# EAGLE board offical board (EAGLE 6.5.0)
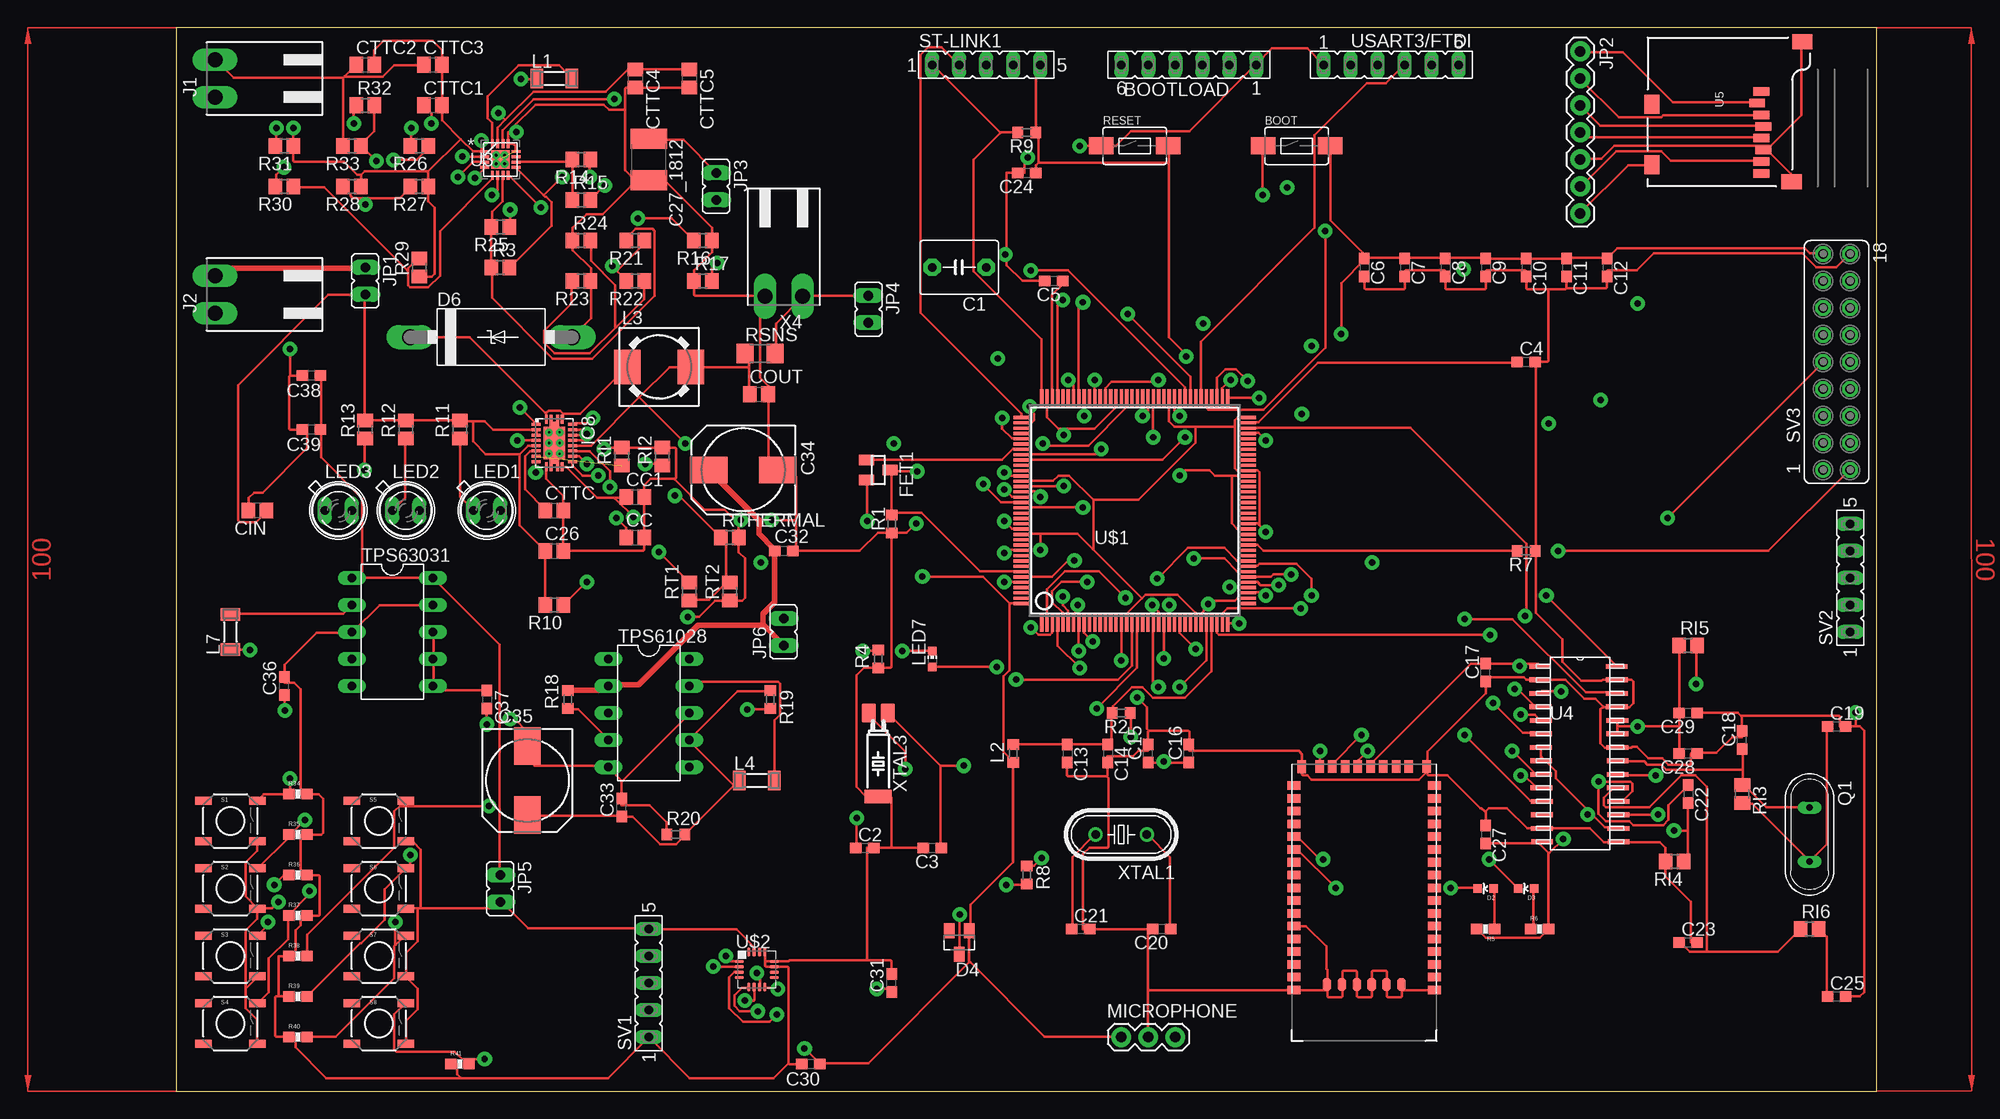
[diagram p6: board, top side]
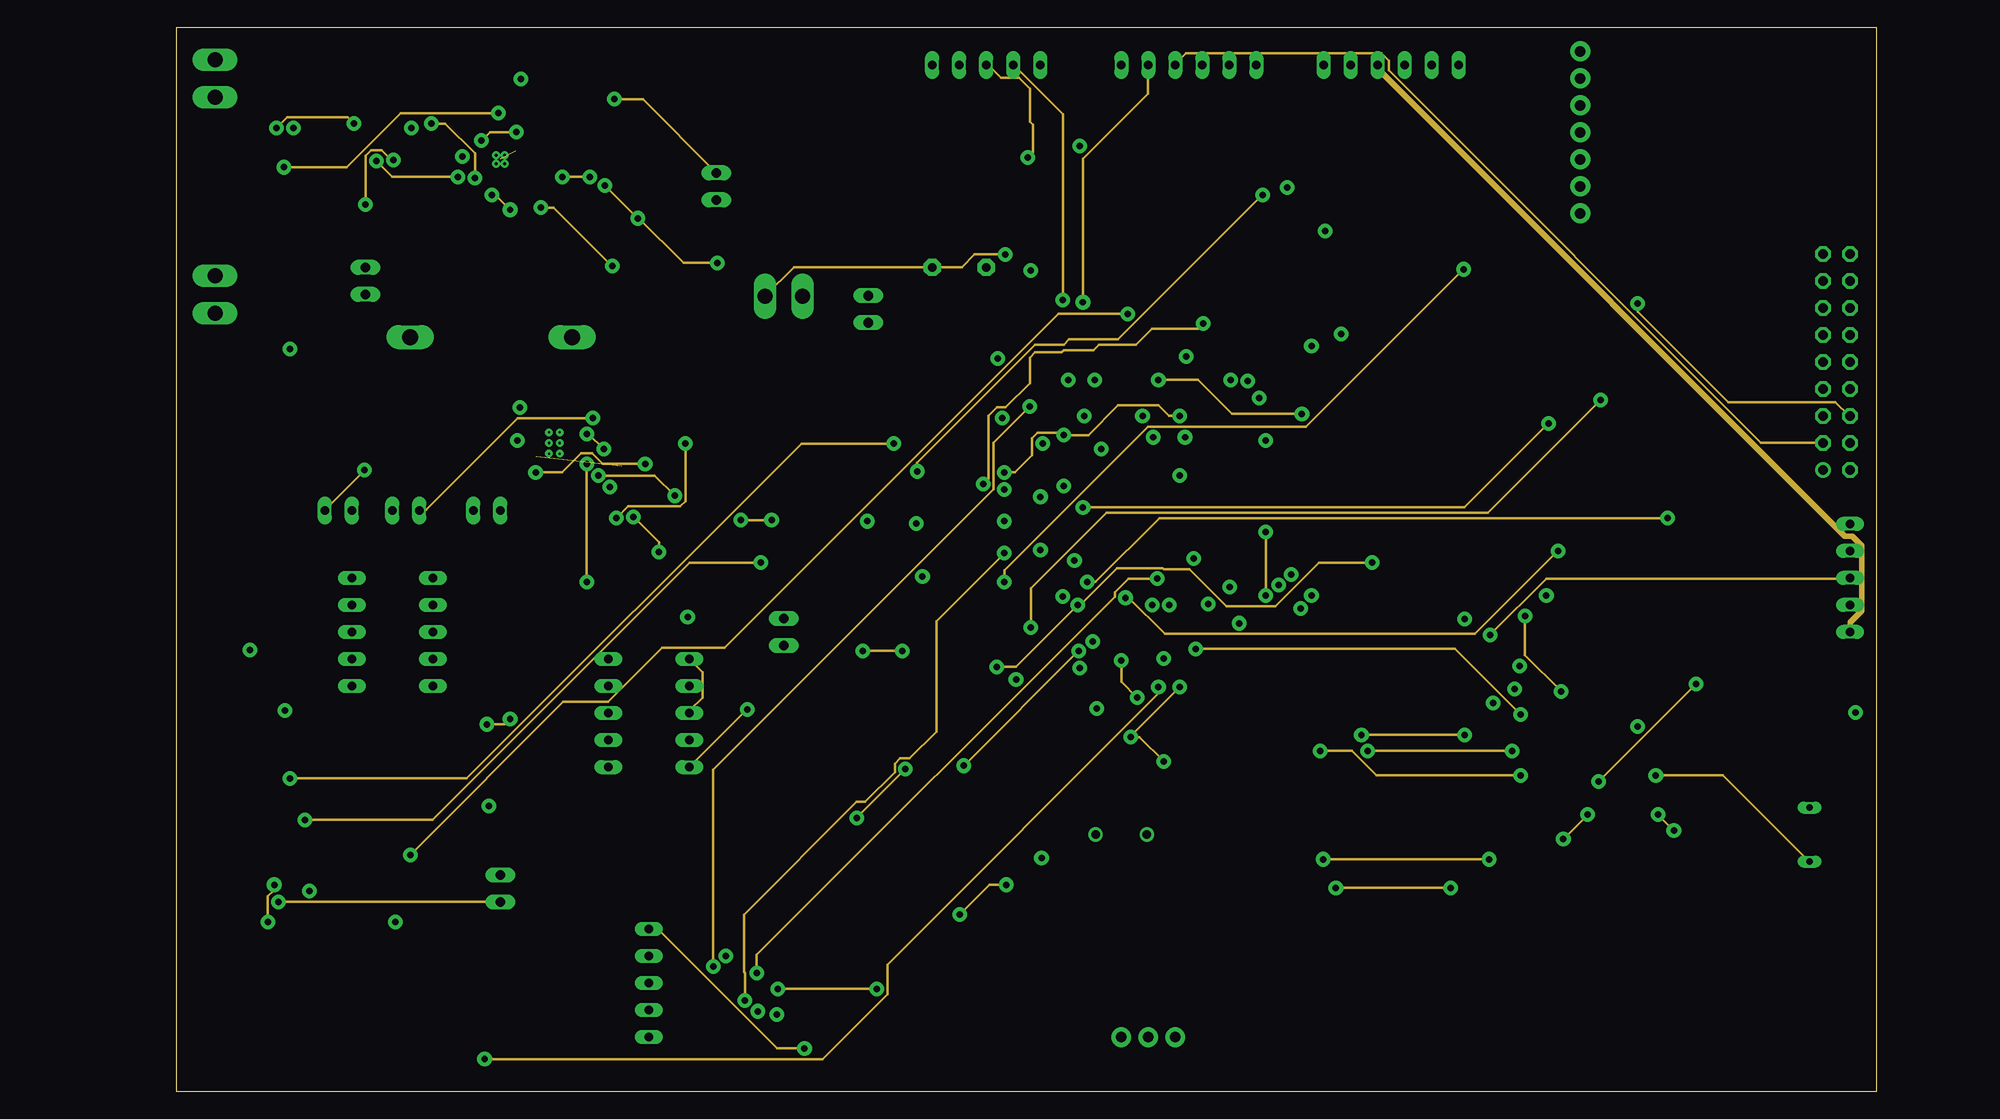
[diagram p7: board, inner layer Route2]
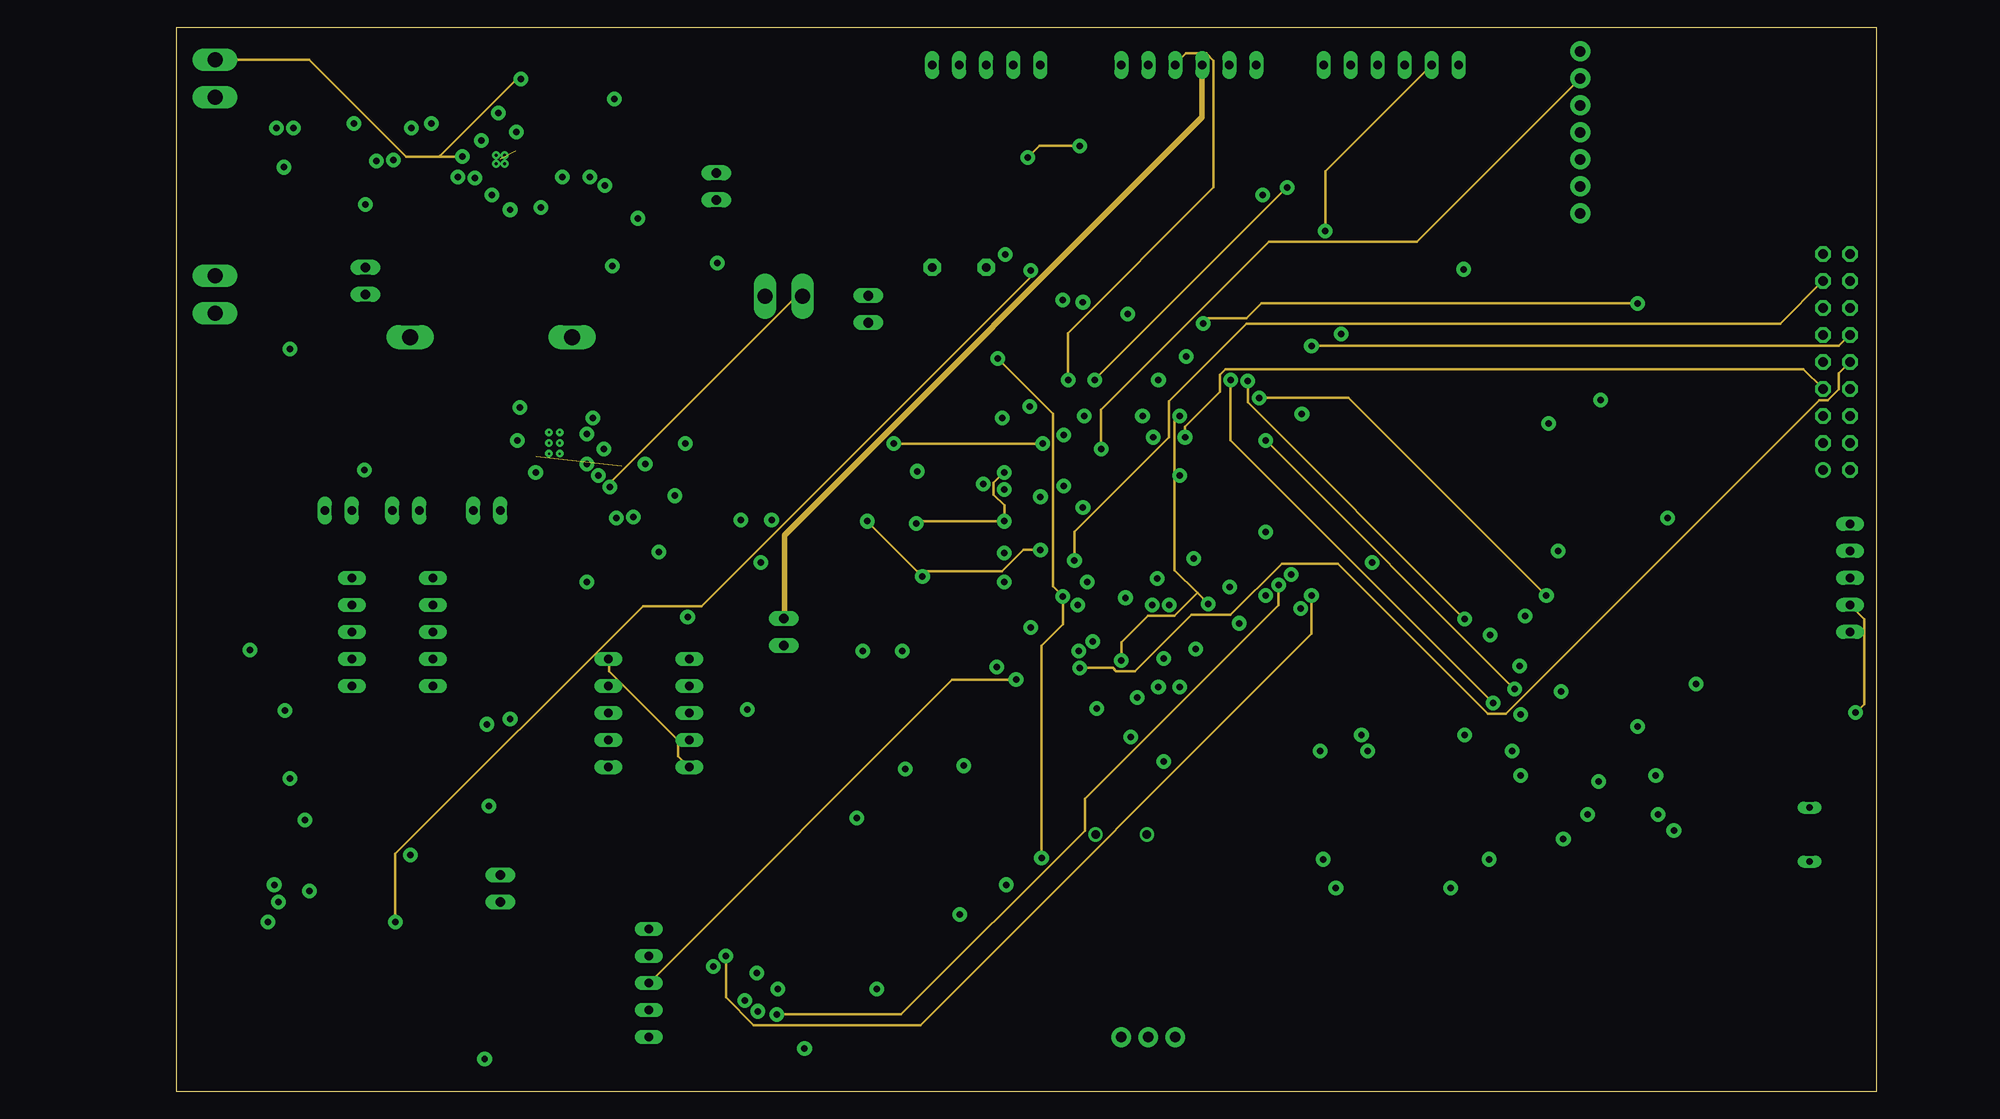
[diagram p8: board, inner layer Route3]
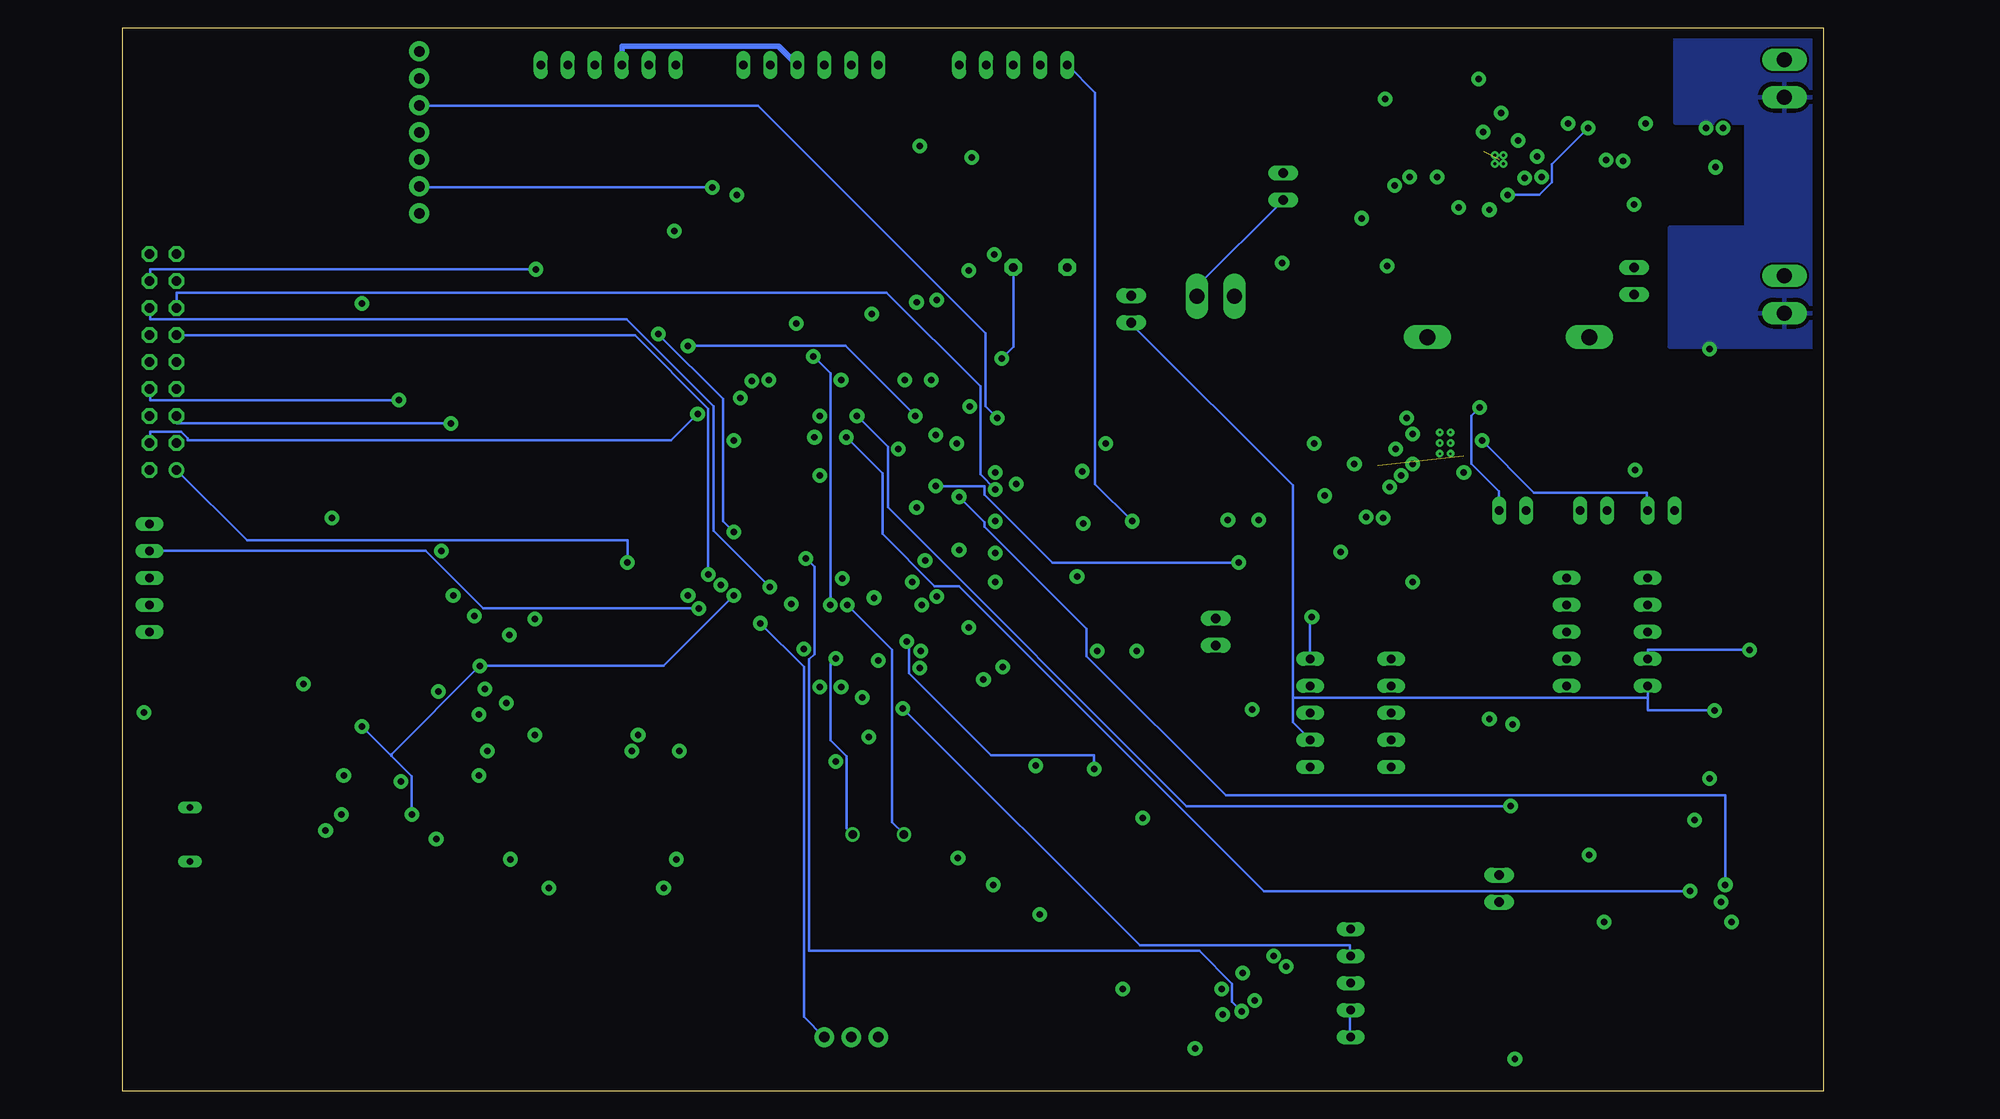
[diagram p9: board, bottom side, seen from below]

Size 160 x 100 mm. Coordinates in mm from the lower left corner, seen from the top.
Outline: 0,0 160,0 160,100 0,100 0,0
Copper layers (1*2*3*16): Top 0.035mm / dielectric 1.5mm / Route2 0.035mm / dielectric 0.15mm / Route3 0.035mm / dielectric 0.2mm / Bottom 0.035mm
Design rules "default *": minimum track width 10mil, minimum drill 24mil, track to track 7mil, track to pad 7mil, pad to pad 7mil, via to via 7mil, smd to smd 7mil, copper to edge 40mil, drill to drill 15mil, minimum pad ring 10mil, minimum via ring 15mil, stop-mask expansion 4mil, vias tented up to drill 0mil, thermal gap 15mil
Net classes: 2 thin_power: width 0.254 mm; 3 power usb: width 0.508 mm, drill 0.406 mm, clearance 0.203 mm

## Footprints (pad centres in the part's own frame; a part is rotated, then mirrored left to right if it is on the bottom)
TACTILE-SWITCH-1101NE = smd 2.3 x 1.6: P$1 -3.15,0; P$2 3.15,0
FE06 = drill 0.813 long: 1 -6.35,0; 2 -3.81,0; 3 -1.27,0; 4 1.27,0; 5 3.81,0; 6 6.35,0
C5B5 = drill 0.813 pad 1.6 octagon: 1 -2.54,0; 2 2.54,0
C0603 = smd 1.1 x 1: 1 -0.85,0; 2 0.85,0
C0805 = smd 1.3 x 1.5: 1 -0.85,0; 2 0.85,0
C1812 = smd 1.9 x 3.4: 1 -1.95,0; 2 1.95,0
150CLZ-0810 = smd 3.5 x 2.5: + 3.25,0; - -3.25,0
LED-0603 = smd 0.8 x 0.8: A 0,-0.75; C 0,0.75
SOT23 = smd 1 x 1.4: 1 -0.95,-1.1; 2 0.95,-1.1; 3 0,1.1
C4111-15 = drill 1.499 long: A 7.62,0; C -7.62,0
SUPER-SOT3 = smd 1 x 1.4: 1 -0.95,-1.1; 2 0.95,-1.1; 3 0,1.1
QFN20_3,5X4,5 = smd 0.85 x 0.28: 1 -2.225,-0.75; 10 2.225,-0.75; 11 2.225,0.75; 20 -2.225,0.75 | smd 0.28 x 0.85: 2 -1.75,-1.725; 3 -1.25,-1.725; 4 -0.75,-1.725; 5 -0.25,-1.725; 6 0.25,-1.725; 7 0.75,-1.725; 8 1.25,-1.725; 9 1.75,-1.725; 12 1.75,1.725; 13 1.25,1.725; 14 0.75,1.725; 15 0.25,1.725; 16 -0.25,1.725; 17 -0.75,1.725; 18 -1.25,1.725; 19 -1.75,1.725 | smd 3.05 x 2.05: EXP 0,0 | drill 0.2 pad 0.3: EXP@1 -1,0.5; EXP@2 0,0.5; EXP@3 1,0.5; EXP@4 -1,-0.5; EXP@5 0,-0.5; EXP@6 1,-0.5 | smd 1.125 x 0.28: EXP@7 -2.075,0.3; EXP@8 -2.075,-0.3; EXP@9 2.075,0.3; EXP@10 2.075,-0.3 | smd 0.45 x 0.4: EXP@11 -1.75,0; EXP@12 1.75,0
90-2 = drill 1.422 long: 1 -1.75,5.25; 2 1.75,5.25
JP1 = drill 0.914 long: 1 0,-1.27; 2 0,1.27
1X07 = drill 1.016 pad 1.88: 1 0,0; 2 2.54,0; 3 5.08,0; 4 7.62,0; 5 10.16,0; 6 12.7,0; 7 15.24,0
SM-1206 = smd 1.2 x 1.8: 1 -1.65,0; 2 1.65,0
RCL_L0603 = smd 1 x 1.1: 1 -0.85,0; 2 0.85,0
DR73 = smd 2.5 x 3.25: 1 -3,0; 2 3,0
SFH482 = drill 0.813 long: A -1.27,0; K 1.27,0
CHIP-LED0603 = smd 0.8 x 0.8: A 0,-0.75; C 0,0.75
1X03 = drill 1.016 pad 1.88: 1 0,0; 2 2.54,0; 3 5.08,0
QS = drill 0.61 long: 1 -2.54,0; 2 2.54,0
R0603 = smd 1 x 1.1: 1 -0.85,0; 2 0.85,0
R0805 = smd 1.3 x 1.5: 1 -0.85,0; 2 0.85,0
0603-RES = smd 1.1 x 1: 1 -0.85,0; 2 0.85,0
R1206 = smd 1.6 x 1.803: 1 -1.422,0; 2 1.422,0
TACTILE_SWITCH_SMD = smd 1.524 x 0.762: 1 -2.54,1.905; 2 2.54,1.905; 3 -2.54,-1.905; 4 2.54,-1.905
FE05-1 = drill 0.813 long: 1 -5.08,0; 2 -2.54,0; 3 0,0; 4 2.54,0; 5 5.08,0
FE09-2 = drill 0.914: 1 -10.16,1.27 | drill 0.914 octagon: 2 -10.16,-1.27; 3 -7.62,1.27; 4 -7.62,-1.27; 5 -5.08,1.27; 6 -5.08,-1.27; 7 -2.54,1.27; 8 -2.54,-1.27; 9 0,1.27; 10 0,-1.27; 11 2.54,1.27; 12 2.54,-1.27; 13 5.08,1.27; 14 5.08,-1.27; 15 7.62,1.27; 16 7.62,-1.27; 17 10.16,1.27; 18 10.16,-1.27
DIL10 = drill 0.813 long: 1 -5.08,-3.81; 2 -2.54,-3.81; 3 0,-3.81; 4 2.54,-3.81; 5 5.08,-3.81; 6 5.08,3.81; 7 2.54,3.81; 8 0,3.81; 9 -2.54,3.81; 10 -5.08,3.81
RN-52 = smd 1.2 x 0.8: 1 -6.6,8.33; 2 -6.6,7.13; 3 -6.6,5.93; 4 -6.6,4.73; 5 -6.6,3.53; 6 -6.6,2.33; 7 -6.6,1.13; 8 -6.6,-0.07; 9 -6.6,-1.27; 10 -6.6,-2.47; 11 -6.6,-3.67; 12 -6.6,-4.87; 13 -6.6,-6.07; 14 -6.6,-7.27; 15 -6.6,-8.47; 16 -6.6,-9.67; 25 6.6,-9.67; 26 6.6,-8.47; 27 6.6,-7.27; 28 6.6,-6.07; 29 6.6,-4.87; 30 6.6,-3.67; 31 6.6,-2.47; 32 6.6,-1.27; 33 6.6,-0.07; 34 6.6,1.13; 35 6.6,2.33; 36 6.6,3.53; 37 6.6,4.73; 38 6.6,5.93; 39 6.6,7.13; 40 6.6,8.33; G1 -6.6,9.53; G4 6.6,9.53 | smd 0.8 x 1.2: 17 -4.2,-11.47; 18 -3,-11.47; 19 -1.8,-11.47; 20 -0.6,-11.47; 21 0.6,-11.47; 22 1.8,-11.47; 23 3,-11.47; 24 4.2,-11.47; G2 -5.9,-11.47; G3 5.9,-11.46; RFG1 -3.5,9.03; RFG2 -2.1,9.03; RFG3 -0.7,9.03; RFG4 0.7,9.03; RFG5 2.1,9.03; RFG6 3.5,9.03
RGT16_1P7X1P7 = smd 0.838 x 0.279: 1 -1.475,0.75; 2 -1.475,0.25; 3 -1.475,-0.25; 4 -1.475,-0.75; 9 1.475,-0.75; 10 1.475,-0.25; 11 1.475,0.25; 12 1.475,0.75 | smd 0.279 x 0.838: 5 -0.75,-1.475; 6 -0.25,-1.475; 7 0.25,-1.475; 8 0.75,-1.475; 13 0.75,1.475; 14 0.25,1.475; 15 -0.25,1.475; 16 -0.75,1.475 | smd 1.702 x 1.702: 17 0,0 | drill 0.254: V -0.406,-0.406; V_1 -0.406,0.406; V_2 0.406,-0.406; V_3 0.406,0.406
DB28 = smd 2.057 x 0.432: 27 3.439,3.125; 28 3.429,4.385; 29 3.449,0.585; 30 3.439,1.845; 31 3.519,-1.955; 32 3.509,-0.695; 33 -3.761,3.125; 34 -3.771,4.385; 35 3.529,-4.495; 36 3.519,-3.235; 37 3.539,-7.035; 38 3.529,-5.775; 39 3.609,-9.575; 40 3.599,-8.315; 41 3.619,-12.115; 42 3.609,-10.855; 43 -3.751,0.585; 44 -3.761,1.845; 45 -3.681,-1.955; 46 -3.691,-0.695; 47 -3.671,-4.495; 48 -3.681,-3.235; 49 -3.661,-7.035; 50 -3.671,-5.775; 51 -3.591,-9.575; 52 -3.601,-8.315; 53 -3.581,-12.115; 54 -3.591,-10.855
MICRO-SD-SOCKET-PP = smd 0.8 x 1.5: 1 -8.94,10.7; 2 -7.84,10.3; 3 -6.74,10.7; 4 -5.64,10.9; 5 -4.54,10.7; 6 -3.44,10.9; 7 -2.34,10.7; 8 -1.24,10.7 | smd 1.8 x 1.4: CD1 -7.75,0.4; CD2 -2.05,0.4 | smd 1.4 x 1.9: GND1 -13.6,14.55; GND2 -0.45,13.55
QFN144 = smd 0.3 x 1.6: 1 -10.02,-11.87; 2 -9.52,-11.87; 3 -9.02,-11.87; 4 -8.52,-11.87; 5 -8.02,-11.87; 6 -7.52,-11.87; 7 -7.02,-11.87; 8 -6.52,-11.87; 9 -6.02,-11.87; 10 -5.52,-11.87; 11 -5.02,-11.87; 12 -4.52,-11.87; 13 -4.02,-11.87; 14 -3.52,-11.87; 15 -3.02,-11.87; 16 -2.52,-11.87; 17 -2.02,-11.87; 18 -1.52,-11.87; 19 -1.02,-11.87; 20 -0.52,-11.87; 21 -0.02,-11.87; 22 0.48,-11.87; 23 0.98,-11.87; 24 1.48,-11.87; 25 1.98,-11.87; 26 2.48,-11.87; 27 2.98,-11.87; 28 3.48,-11.87; 29 3.98,-11.87; 30 4.48,-11.87; 31 4.98,-11.87; 32 5.48,-11.87; 33 5.98,-11.87; 34 6.48,-11.87; 35 6.98,-11.87; 36 7.48,-11.87; 73 7.48,9.33; 74 6.98,9.33; 75 6.48,9.33; 76 5.98,9.33; 77 5.48,9.33; 78 4.98,9.33; 79 4.48,9.33; 80 3.98,9.33; 81 3.48,9.33; 82 2.98,9.33; 83 2.48,9.33; 84 1.98,9.33; 85 1.48,9.33; 86 0.98,9.33; 87 0.48,9.33; 88 -0.02,9.33; 89 -0.52,9.33; 90 -1.02,9.33; 91 -1.52,9.33; 92 -2.02,9.33; 93 -2.52,9.33; 94 -3.02,9.33; 95 -3.52,9.33; 96 -4.02,9.33; 97 -4.52,9.33; 98 -5.02,9.33; 99 -5.52,9.33; 100 -6.02,9.33; 101 -6.52,9.33; 102 -7.02,9.33; 103 -7.52,9.33; 104 -8.02,9.33; 105 -8.52,9.33; 106 -9.02,9.33; 107 -9.52,9.33; 108 -10.02,9.33 | smd 1.6 x 0.3: 37 9.33,-10.02; 38 9.33,-9.52; 39 9.33,-9.02; 40 9.33,-8.52; 41 9.33,-8.02; 42 9.33,-7.52; 43 9.33,-7.02; 44 9.33,-6.52; 45 9.33,-6.02; 46 9.33,-5.52; 47 9.33,-5.02; 48 9.33,-4.52; 49 9.33,-4.02; 50 9.33,-3.52; 51 9.33,-3.02; 52 9.33,-2.52; 53 9.33,-2.02; 54 9.33,-1.52; 55 9.33,-1.02; 56 9.33,-0.52; 57 9.33,-0.02; 58 9.33,0.48; 59 9.33,0.98; 60 9.33,1.48; 61 9.33,1.98; 62 9.33,2.48; 63 9.33,2.98; 64 9.33,3.48; 65 9.33,3.98; 66 9.33,4.48; 67 9.33,4.98; 68 9.33,5.48; 69 9.33,5.98; 70 9.33,6.48; 71 9.33,6.98; 72 9.33,7.48; 109 -11.87,7.48; 110 -11.87,6.98; 111 -11.87,6.48; 112 -11.87,5.98; 113 -11.87,5.48; 114 -11.87,4.98; 115 -11.87,4.48; 116 -11.87,3.98; 117 -11.87,3.48; 118 -11.87,2.98; 119 -11.87,2.48; 120 -11.87,1.98; 121 -11.87,1.48; 122 -11.87,0.98; 123 -11.87,0.48; 124 -11.87,-0.02; 125 -11.87,-0.52; 126 -11.87,-1.02; 127 -11.87,-1.52; 128 -11.87,-2.02; 129 -11.87,-2.52; 130 -11.87,-3.02; 131 -11.87,-3.52; 132 -11.87,-4.02; 133 -11.87,-4.52; 134 -11.87,-5.02; 135 -11.87,-5.52; 136 -11.87,-6.02; 137 -11.87,-6.52; 138 -11.87,-7.02; 139 -11.87,-7.52; 140 -11.87,-8.02; 141 -11.87,-8.52; 142 -11.87,-9.02; 143 -11.87,-9.52; 144 -11.87,-10.02
QFN16 = smd 0.85 x 0.3: 1 -1.655,0.75; 2 -1.655,0.25; 3 -1.655,-0.25; 4 -1.655,-0.75; 9 1.655,-0.75; 10 1.655,-0.25; 11 1.655,0.25; 12 1.655,0.75 | smd 0.3 x 0.85: 5 -0.75,-1.655; 6 -0.25,-1.655; 7 0.25,-1.655; 8 0.75,-1.655; 13 0.75,1.655; 14 0.25,1.655; 15 -0.25,1.655; 16 -0.75,1.655
HC49U-V = drill 0.813: 1 -2.413,0; 2 2.413,0
CRYSTAL_TC26H_3_REPAIR_SMD_SMALL_PITCH = smd 1.27 x 1.778: 1 -0.889,-3.81; 2 0.889,-3.81 | smd 2.54 x 1.27: GND 0,4.064

## Placement (x,y rotation side)
BOOT  SWITCH-MOMENTARY-2-SMD-1101NE  [TACTILE-SWITCH-1101NE]  105.41,88.9 0 top
BOOTLOAD  [FE06]  95.25,96.52 180 top
C1  0.22F  [C5B5]  73.66,77.47 180 top
C2  6.8pF  [C0603]  64.77,22.86 0 top
C3  6.8pF  [C0603]  71.12,22.86 180 top
C4  2u2  [C0603]  127,68.58 0 top
C5  2u2  [C0603]  82.55,76.2 180 top
C6  100nF  [C0603]  111.76,77.47 270 top
C7  100nF  [C0603]  115.57,77.47 270 top
C8  100nF  [C0603]  119.38,77.47 270 top
C9  100nF  [C0603]  123.19,77.47 270 top
C10  100nF  [C0603]  127,77.47 270 top
C11  100nF  [C0603]  130.81,77.47 270 top
C12  1uF  [C0603]  134.62,77.47 270 top
C13  1uF  [C0603]  83.82,31.75 270 top
C14  100nF  [C0603]  87.63,31.75 270 top
C15  1uF  [C0603]  91.44,31.75 90 top
C16  100nF  [C0603]  95.25,31.75 90 top
C17  0.1uF  [C0603]  123.19,39.37 90 top
C18  22pF  [C0603]  147.32,33.02 90 top
C19  22pF  [C0603]  156.21,34.29 0 top
C20  22pF  [C0603]  92.71,15.24 180 top
C21  22pf  [C0603]  85.09,15.24 0 top
C22  0.1uF  [C0603]  142.24,27.94 270 top
C23  470pF  [C0603]  142.24,13.97 0 top
C24  100nF  [C0603]  80.01,86.36 180 top
C25  0.0047uF  [C0603]  156.21,8.89 0 top
C26  0.1uF  [C0805]  35.56,50.8 0 top
C27  0.1uF  [C0603]  123.19,24.13 270 top
C27_1812  100uF  [C1812]  44.45,87.63 270 top
C28  0.1uF  [C0603]  142.24,31.75 180 top
C29  0.1uF  [C0603]  142.24,35.56 180 top
C30  0.1uF  [C0603]  59.69,2.54 180 top
C31  0.1uF  [C0603]  67.31,10.16 90 top
C32  2.2uF  [C0603]  57.15,50.8 0 top
C33  [C0603]  41.91,26.67 90 top
C34  347uF  [150CLZ-0810]  53.34,58.42 180 top
C35  [150CLZ-0810]  33.02,29.21 270 top
C36  10uF  [C0603]  10.16,38.1 90 top
C37  10uF  [C0603]  29.21,36.83 270 top
C38  10uF  [C0603]  12.7,67.31 180 top
C39  10uF  [C0603]  12.7,62.23 180 top
CC  0.1uF  [C0805]  43.18,52.07 0 top
CC1  0.1uF  [C0805]  43.18,55.88 0 top
CIN  10uF  [C0805]  7.62,54.61 180 top
COUT  10uF  [C0805]  54.81,65.56 0 top
CTTC  0.1uF  [C0805]  35.56,54.61 0 top
CTTC1  0.1uF  [C0805]  24.13,92.71 0 top
CTTC2  4.7uF  [C0805]  17.78,96.52 0 top
CTTC3  0.1uF  [C0805]  24.13,96.52 0 top
CTTC4  4.7uF  [C0805]  43.18,95.25 270 top
CTTC5  0.1uF  [C0805]  48.26,95.25 270 top
D2  GREEN  [LED-0603]  123.19,19.05 90 top
D3  RED  [LED-0603]  127,19.05 90 top
D4  BAT54  [SOT23]  73.66,13.97 180 top
D6  MMBZ18VALT1  [C4111-15]  29.61,70.92 0 top
FET1  DMP2160UW  [SUPER-SOT3]  66.04,58.42 270 top
IC8  BQ24123  [QFN20_3,5X4,5]  35.56,60.96 270 top
J1  [90-2]  8.89,95.25 90 top
J2  [90-2]  8.89,74.93 90 top
JP1  [JP1]  17.78,76.2 180 top
JP2  [1X07]  132.08,97.79 270 top
JP3  [JP1]  50.8,85.09 180 top
JP4  [JP1]  65.11,73.55 180 top
JP5  [JP1]  30.48,19.05 180 top
JP6  [JP1]  57.15,43.18 0 top
L1  22uH  [SM-1206]  35.56,95.25 0 top
L2  [RCL_L0603]  78.74,31.75 90 top
L3  10uH  [DR73]  45.42,68.12 0 top
L4  [SM-1206]  54.61,29.21 0 top
L7  1.5uH  [SM-1206]  5.08,43.18 90 top
LED1  [SFH482]  29.21,54.61 0 top
LED2  [SFH482]  21.59,54.61 0 top
LED3  [SFH482]  15.24,54.61 0 top
LED7  [CHIP-LED0603]  71.12,40.64 0 top
MICROPHONE  [1X03]  88.9,5.08 0 top
Q1  14.7456MHz  [QS]  153.67,24.13 270 top
R1  10K  [R0603]  67.31,53.34 90 top
R2  47R  [R0603]  88.9,35.56 180 top
R3  1.43M  [R0805]  30.48,77.47 0 top
R4  270R  [R0603]  66.04,40.64 90 top
R5  330  [0603-RES]  123.19,15.24 180 top
R6  330  [0603-RES]  128.27,15.24 0 top
R7  10K  [R0603]  127,50.8 180 top
R8  100R  [R0603]  80.01,20.32 270 top
R9  10K  [R0603]  80.01,90.17 180 top
R10  10k  [R0805]  35.56,45.72 180 top
R11  1.5k  [R0805]  26.67,62.23 90 top
R12  1.5k  [R0805]  21.59,62.23 90 top
R13  1.5k  [R0805]  17.78,62.23 90 top
R14  4.22M  [R0805]  38.1,87.63 180 top
R15  4.42M  [R0805]  38.1,83.82 0 top
R16  0  [R0805]  49.53,80.01 180 top
R17  500k  [R0805]  49.53,76.2 0 top
R18  [R0603]  36.83,36.83 90 top
R19  [R0603]  55.88,36.83 270 top
R20  [R0603]  46.99,24.13 0 top
R21  4.42M  [R0805]  43.18,80.01 180 top
R22  5.6M  [R0805]  43.18,76.2 180 top
R23  0  [R0805]  38.1,76.2 180 top
R24  500K  [R0805]  38.1,80.01 0 top
R25  4.02M  [R0805]  30.48,81.28 180 top
R26  5.90M  [R0805]  22.86,88.9 180 top
R27  0  [R0805]  22.86,85.09 180 top
R28  500K  [R0805]  16.51,85.09 180 top
R29  60C  [R0805]  22.86,77.47 90 top
R30  120C  [R0805]  10.16,85.09 180 top
R31  10.0M  [R0805]  10.16,88.9 180 top
R32  5.60M  [R0805]  17.78,92.71 0 top
R33  4.42M  [R0805]  16.51,88.9 180 top
R34  10K  [0603-RES]  11.43,27.94 0 top
R35  10K  [0603-RES]  11.43,24.13 0 top
R36  10K  [0603-RES]  11.43,20.32 0 top
R37  10K  [0603-RES]  11.43,16.51 0 top
R38  10K  [0603-RES]  11.43,12.7 0 top
R39  10K  [0603-RES]  11.43,8.89 0 top
R40  10K  [0603-RES]  11.43,5.08 0 top
R41  10K  [0603-RES]  26.67,2.54 0 top
RESET  SWITCH-MOMENTARY-2-SMD-1101NE  [TACTILE-SWITCH-1101NE]  90.17,88.9 0 top
RI1  7.5k  [R0805]  41.91,59.69 90 top
RI2  7.5k  [R0805]  45.72,59.69 90 top
RI3  1M  [R0805]  147.32,27.94 270 top
RI4  4.7  [R0805]  140.97,21.59 180 top
RI5  4.7  [R0805]  142.24,41.91 0 top
RI6  1K  [R0805]  153.67,15.24 0 top
RSNS  0.1  [R1206]  54.91,69.38 0 top
RT1  9.31k  [R0805]  48.26,46.99 90 top
RT2  442k  [R0805]  52.07,46.99 90 top
RTHERMAL  [R0805]  52.07,52.07 0 top
S1  [TACTILE_SWITCH_SMD]  5.08,25.4 0 top
S2  [TACTILE_SWITCH_SMD]  5.08,19.05 0 top
S3  [TACTILE_SWITCH_SMD]  5.08,12.7 0 top
S4  [TACTILE_SWITCH_SMD]  5.08,6.35 0 top
S5  [TACTILE_SWITCH_SMD]  19.05,25.4 0 top
S6  [TACTILE_SWITCH_SMD]  19.05,19.05 0 top
S7  [TACTILE_SWITCH_SMD]  19.05,12.7 0 top
S8  [TACTILE_SWITCH_SMD]  19.05,6.35 0 top
ST-LINK1  [FE05-1]  76.2,96.52 0 top
SV1  GPS Header  [FE05-1]  44.45,10.16 90 top
SV2  Laser Header  [FE05-1]  157.48,48.26 90 top
SV3  Camra  [FE09-2]  156.21,68.58 90 top
TPS61028  [DIL10]  44.45,35.56 270 top
TPS63031  [DIL10]  20.32,43.18 270 top
U1  BLUETOOTH-RN-52  [RN-52]  111.76,19.05 180 top
U3  BQ25504_RGT_16  [RGT16_1P7X1P7]  30.48,87.63 0 top
U4  SRC4193_DB_28  [DB28]  132.08,35.56 0 top
U5  microSD  [MICRO-SD-SOCKET-PP]  138.43,85.09 270 top
U$1  STM32F746  [QFN144]  91.44,55.88 0 top
U$2  QFN16  [QFN16]  54.61,11.43 0 top
USART3/FTDI  [FE06]  114.3,96.52 0 top
X4  [90-2]  57.15,80.01 180 top
XTAL1  8MHz  [HC49U-V]  88.9,24.13 180 top
XTAL3  32768Hz  [CRYSTAL_TC26H_3_REPAIR_SMD_SMALL_PITCH]  66.04,31.75 180 top

## Tracks (layer width: path | path; a pad name or v marks a point on that pad's centre or on a via)
3.3V  (via drill 0.61)
  Top 0.254: C6.1 111.8,78.4 115.5,78.4 C7.1 115.6,78.4 119.3,78.4 C8.1 119.4,78.4 123.1,78.4 C9.1 123.3,78.3 127,78.3 C10.1 127.1,78.3 130.7,78.3 C11.1 130.9,78.4 134.6,78.4 C12.1 135.6,79.3 153.2,79.3 153.7,78.8 154.9,78.8 SV3.17 | BOOT.P$2 108.6,88.9 108.6,81.9 112,78.5 C6.1 | v102.5,46.6 102.2,46.9 100.8,46.9 U$1.39 | 101.85,53.25 101.7,53.4 100.8,53.4 U$1.52 | 101.85,53.25 v102.5,52.6 | 101.85,53.25 101.9,53.3 101.9,58.2 101.7,58.4 100.8,58.4 U$1.62 100.7,58.4 99.8,58.4 99.6,58.6 99.6,62.5 | 99.6,62.5 99.6,63.1 99.9,63.4 100.7,63.4 U$1.72 | 99.6,62.5 95.9,62.5 | 95.9,62.5 93.9,62.5 93.4,63 93.4,65.2 U$1.84 | 90.85,46.35 91.2,46.7 94.2,46.7 95.9,45 95.9,44.1 U$1.30 | 90.85,46.35 89.4,44.9 89.4,44.1 U$1.17 | 81.3,52.4 84.8,52.4 86.25,50.95 | 81.3,52.4 79.6,52.4 U$1.131 | 90.85,46.35 86.25,50.95 | 86.3,55.6 84,57.9 83,57.9 82.5,57.4 79.6,57.4 U$1.121 | 86.3,55.6 86.3,51 86.25,50.95 | 95.9,62.5 95.9,61 90.5,55.6 86.3,55.6 | 126.4,40.2 128.1,40.2 128.3,40 U4.34 | 126.4,40.2 123.2,40.2 C17.2 123.1,40.2 121.8,40.2 112.4,30.8 112.4,30.6 U1.20 | 135.6,34.3 135.6,33.7 U4.31 | 135.6,34.3 135.6,34.8 U4.32 | 141.4,34.3 141.4,35.5 C29.2 141.4,35.6 RI5.1 | 141.4,34.3 141.4,31.8 C28.2 | 141.4,34.3 v137.5,34.3 135.6,34.3 | R5.2 122.4,15.2 123.2,14.4 128.3,14.4 129.1,15.2 R6.2 129.1,15.3 129.1,22.4 | 128.3,23.3 123.2,23.3 C27.2 | 128.3,23.3 128.4,23.4 U4.53 | 129.1,22.4 128.3,23.2 128.3,23.3 | 128.4,31.4 128.4,31.1 U4.47 | 128.4,31.4 128.4,32.3 U4.48 | 133,26.2 129.8,29.4 129.8,30.1 128.5,31.4 128.4,31.4 | 133,26.2 134.4,24.8 135.6,24.8 U4.42 | v130.5,23.7 129.2,22.4 129.1,22.4 | 133,26.2 v132.8,26 | v126.4,40 126.4,40.2
  Top 0.254: v109.6,71.2 109.6,76 111.8,78.2 C6.1 | 6.5,9.6 6.5,7.8 7.6,6.7 7.6,4.5 S4.4 | 6.5,9.6 7.6,10.7 S3.4 | 6.5,9.6 6.5,15.1 7.6,16.2 7.6,17.1 S2.4 | S1.4 7.6,23.4 7.6,22.6 6.5,21.5 6.5,18.3 7.6,17.2 S2.4 | U$2.15 54.4,13.1 54.4,13.5 52.7,15.2 44.5,15.2 SV1.5 44.4,15.3 33.1,15.3 30.6,17.8 JP5.2 29.9,17.2 23,17.2 | S8.4 21.6,4.5 21.6,6.6 22.7,7.7 22.7,9.6 21.6,10.7 S7.4 21.6,10.9 21.6,13 22.7,14.1 22.7,17.2 | 23,17.2 22.7,17.2 | 22.7,17.2 21.6,17.2 S6.4 | 23,17.2 23,22.7 22.3,23.4 21.6,23.4 S5.4 | v9.6,17.8 9,17.2 7.7,17.2 S2.4 | 77.5,90.2 79.1,90.2 R9.2 | 77.5,90.2 71.2,96.5 ST-LINK1.1 | U$1.108 81.4,65.3 81.4,70.7 75,77.1 75,87.6 77.5,90.1 77.5,90.2 | v65,53.6 65,57.4 FET1.2 | v70.2,48.4 75.9,48.4 78.4,45.9 | 78.4,45.9 79.5,45.9 U$1.144 | 74.6,12.1 65.1,2.6 60.6,2.6 C30.1 60.5,2.6 v59.1,4 | 74.6,12.1 74.6,15 D4.1 74.7,15.1 74.7,17.5 78.7,21.5 78.7,30.9 L2.1 78.7,31 77.8,31.9 77.8,39 78.4,39.6 78.4,45.9 | MICROPHONE.1 88.9,5.1 81.7,5.1 74.7,12.1 74.6,12.1 | v81.3,50.9 81.3,52.4
  Route2 0.254: v102.5,52.6 v102.5,46.6 | v132.8,26 v130.5,23.7 | v9.6,17.8 30.4,17.8 JP5.2 | v59.1,4 56.5,4 45.3,15.2 44.5,15.2 SV1.5
  Route3 0.254: v65,53.6 v70.2,48.4 69.8,48.9 77.7,48.9 79.7,50.9 v81.3,50.9
  Bottom 0.254: 134.75,31.55 132.8,29.6 v132.8,26 | 134.75,31.55 v137.5,34.3 | 134.75,31.55 134.7,31.6 134.7,31.7 v126.4,40 109.1,40 v102.5,46.6 | v109.6,71.2 103.5,65.1 103.5,53.6 v102.5,52.6 | ST-LINK1.1 68.5,93.9 68.5,57.1 v65,53.6
+5V
  Route2 0.508: SV2.1 157.5,43.2 157.5,44.1 158.6,45.2 158.6,51.3 157.7,52.2 157,52.2 113.1,96.1 113.1,96.5 USART3/FTDI.3
  Route3 0.508: JP6.2 57.2,44.5 57.2,52.3 96.5,91.6 96.5,96.5 BOOTLOAD.3
  Bottom 0.508: BOOTLOAD.3 98.3,98.3 113,98.3 113,96.6 USART3/FTDI.3
BOOT0  (via drill 0.61)
  Top 0.254: U$1.138 79.5,48.9 75.6,48.9 70.1,54.4 67.4,54.4 R1.2 67.3,58.3 67.2,58.4 FET1.3 67.4,58.3 v69.7,58.3 | v102.2,84.3 102.2,88.9 BOOT.P$1
  Route2 0.254: v102.2,84.3 88.6,70.7 84,70.7 83.5,70.2 80.8,70.2 69.7,59.1 v69.7,58.3
CD2
  Top 0.254: U5.CD2 138.8,87.1 136.6,87.1 132.1,82.6 JP2.7
CS1
  Top 0.254: U5.2 148.7,93 140.8,93 136.1,97.7 132.1,97.7 JP2.1
GND  (via drill 0.61)  (1 unrouted)
  Top 0.254: U1.G1 118.3,9.5 115.4,9.5 U1.RFG1 115.3,10 115.3,8.9 115.2,8.8 114,8.8 113.9,8.9 113.9,10 U1.RFG2 113.9,10.1 113.9,11.2 113.8,11.3 112.6,11.3 112.5,11.2 112.5,10.1 U1.RFG3 112.5,10 112.5,8.9 112.4,8.8 111.2,8.8 111.1,8.9 111.1,10 U1.RFG4 111.1,10.1 111.1,11.2 111,11.3 109.8,11.3 109.7,11.2 109.7,10.1 U1.RFG5 109.7,10 109.7,8.9 109.6,8.8 108.4,8.8 108.3,8.9 108.3,9.5 | 108.3,9.5 105.2,9.5 U1.G4 105.1,9.5 91.4,9.5 | 108.3,9.5 108.3,10 U1.RFG6 108.3,10.1 108.3,11.4 108.2,11.5 108.2,13.6 106.3,15.5 105.2,15.5 U1.36 | 91.4,9.5 91.4,5.1 MICROPHONE.2 | 91.4,9.5 91.4,15.1 C20.2 91.8,15.2 86,15.2 C21.2 85.9,15.2 85.3,15.2 85.3,22.3 85.9,22.9 87.6,22.9 87.7,23 87.7,29.4 87.5,29.6 | 97.15,45.75 97.5,46.1 99.6,46.1 99.9,46.4 100.7,46.4 U$1.38 | 97.15,45.75 96.7,45.3 96.7,45.2 96.4,44.9 96.4,44.1 U$1.31 | v94.4,63.5 93.9,64 93.9,65.2 U$1.83 | v94.4,57.9 94.9,58.4 97.2,58.4 97.7,57.9 99.3,57.9 | 99.3,57.9 100.7,57.9 U$1.61 | 99.3,57.9 99.3,53.4 99.8,52.9 100.7,52.9 U$1.51 | v97.1,45.8 97.15,45.75 | 87.5,29.6 83.9,29.6 83.8,29.7 83.8,30.9 C13.2 | 87.5,29.6 87.6,29.7 87.6,30.9 C14.2 87.6,31 87.6,31.5 90,31.5 90.5,32 91.4,32 91.4,32.5 C15.2 91.4,32.6 91.4,33.8 91.5,33.9 | 91.5,33.9 95.2,33.9 95.3,33.8 95.3,32.6 C16.2 95.3,32.5 95.3,32 105.6,32 105.9,31.7 105.9,30.6 U1.G3 105.9,30.4 105.9,29.8 106,29.7 106.4,29.7 106.8,29.3 116.9,29.3 117.6,30 U1.G2 | v88.9,40.5 88.9,44 U$1.16 | v90.4,37 91.3,36.1 91.3,34.1 91.5,33.9 | C6.2 111.8,76.6 111.8,75.5 111.9,75.4 115.5,75.4 115.6,75.5 115.6,76.6 C7.2 115.6,76.7 115.6,77.1 115.7,77.2 119.3,77.2 119.4,77.1 119.4,76.7 C8.2 119.4,76.6 119.4,75.5 119.5,75.4 123.1,75.4 123.2,75.5 123.2,76.6 C9.2 123.2,76.7 123.2,77.1 123.3,77.2 126.9,77.2 127,77.1 C10.2 127,75.5 127.1,75.4 129.1,75.4
  Top 0.254: 129.1,75.4 130.7,75.4 130.8,75.5 | 130.8,75.5 130.8,76.6 C11.2 | 130.8,75.5 134.5,75.5 134.6,75.6 134.6,76.6 C12.2 134.6,76.7 134.6,77.1 134.7,77.2 137.4,77.2 139,78.8 153,78.8 154.3,77.5 156.2,77.5 157.4,78.7 SV3.18 | 129.1,75.4 129.1,68.7 129,68.6 127.9,68.6 C4.2 127.9,68.5 127.9,50.8 R7.1 127.9,50.7 127.9,45 130.4,42.5 130.4,40.4 132.2,38.6 134.1,38.6 134.2,38.7 135.4,38.7 U4.27 135.6,38.7 136.9,38.7 137.1,38.5 137.1,36.5 136.7,36.1 135.6,36.1 U4.29 135.5,36.1 134.2,36.1 | 158,34.3 157.1,34.3 C19.2 157,34.3 156.5,34.3 156.5,35.2 156.4,35.3 147.3,35.3 147.25,35.25 | 158,34.3 158.4,34.3 158.8,33.9 158.8,9.3 158.4,8.9 157.1,8.9 C25.2 | 158,34.3 v158,35.6 | 123.2,26.3 123.2,25 C27.1 | 123.2,26.3 123.5,26.6 125.2,26.6 127.1,24.7 128.4,24.7 U4.54 128.6,24.7 133,24.7 134.3,23.4 135.6,23.4 U4.41 135.7,23.4 139.6,23.4 140.1,22.9 140.1,21.7 RI4.2 140.1,21.5 140.1,20.2 142.5,17.8 142.5,14 143,14 C23.2 | U1.G2 117.7,30.6 117.7,31.9 123.2,37.4 123.2,38.4 C17.1 123.2,38.6 123.2,38.8 123.3,38.9 126.8,38.9 127,38.7 128.3,38.7 U4.33 128.4,38.7 130.7,38.7 132.5,36.9 133.5,36.9 134.2,36.2 134.2,36.1 | 147.25,35.25 147.3,35.2 147.3,34 C18.2 147.3,33.8 147.3,33.3 146.4,33.3 144.9,31.8 143.1,31.8 C28.1 143,31.8 142.6,31.8 142.5,31.7 142.5,30.8 142.4,30.7 140.4,30.7 139.8,31.3 138.5,31.3 137.4,32.4 137,32.4 136.9,32.3 135.7,32.3 U4.36 135.5,32.3 134.4,32.3 134,32.7 134,35.9 134.2,36.1 | 147.25,35.25 146.9,35.6 143.1,35.6 C29.1 | 123.2,26.3 123.1,26.3 122.8,26.6 122.7,26.6 119.6,29.7 117.8,29.7 117.7,29.8 117.7,30.4 U1.G2 | TPS63031.9 24.1,45.7 19.1,45.7 16.6,43.2 TPS63031.3 16.5,43.1 13.2,43.1 10.2,40.1 10.2,39 C36.2 10.2,38.9 10.2,38.4 11.1,38.4 11.7,37.8 11.7,27.9 12.2,27.9 R34.2 12.3,27.9 13.4,27.9 13.8,27.5 13.8,24.3 13.6,24.1 12.4,24.1 R35.2 12.2,24.1 11.7,24.1 11.7,20.3 12.2,20.3 R36.2 12.3,20.3 13.4,20.3 13.5,20.2 13.5,16.6 13.4,16.5 12.3,16.5 R37.2 12.2,16.5 11.7,16.5 11.7,15.6 11.2,15.1 11.2,12.7 R38.1 9.6,12.7 9.6,8.9
  Top 0.254: 9.6,8.9 10.5,8.9 R39.1 | 9.6,8.9 9.4,8.9 9.3,8.8 9.3,5.2 9.4,5.1 10.5,5.1 R40.1 10.7,5.1 11.2,5.1 11.2,4.1 14.1,1.2 26.7,1.2 26.75,1.25 | 26.75,1.25 26.8,1.2 40.6,1.2 44.4,5 SV1.1 44.5,5 48.3,1.2 56.2,1.2 57.6,2.6 | 26.75,1.25 26.4,1.6 26.4,2.5 25.9,2.5 R41.1 | 67.3,22.9 70.2,22.9 C3.2 | 67.3,22.9 65.7,22.9 C2.2 65.5,22.9 65,22.9 65,12.3 | 67.3,22.9 67.3,27.6 67.2,27.7 66.1,27.7 XTAL3.GND 66,27.7 64.9,27.7 64,28.6 64,39.1 64.7,39.8 66,39.8 R4.1 66.1,39.8 67.2,39.8 67.3,39.9 67.3,52.4 R1.1 | 55.4,12.2 55.4,13 U$2.13 | 55.4,12.2 55.4,11.8 55.5,11.7 56.2,11.7 U$2.11 56.3,11.7 57.5,11.7 57.6,11.6 57.6,2.6 | 55.4,12.2 56.2,12.2 U$2.12 56.3,12.2 57.6,12.2 57.7,12.3 65,12.3 | 57.6,2.6 57.7,2.5 58.8,2.5 C30.2 | 65,12.3 67.2,12.3 67.3,12.2 67.3,11.1 C31.2 | R29.1 22.9,76.6 24,76.6 24.3,76.9 24.3,83.1 23.7,83.7 23.7,85 R27.1 23.7,85.2 23.7,86.4 23.6,86.5 | 17.4,86.2 17.4,85.1 R28.1 | 17.4,86.2 17.7,86.5 23.6,86.5 | CTTC2.2 18.6,96.6 18.6,97.9 19.5,98.8 24.1,98.8 25,97.9 25,96.6 CTTC3.2 25,96.4 25,92.8 CTTC1.2 25,92.7 25,91.3 26.75,89.55 | U3.12 31.9,88.4 31.9,88.9 31.7,89.1 31.3,89.1 U3.13 31.2,89.2 31.2,90.2 v32,90.2 31.6,90.3 31.6,90.6 33.8,92.8 40.2,92.8 40.7,92.3 42.2,92.3 | 26.75,89.55 27.9,88.4 29,88.4 U3.1 28.7,88.5 v28.7,89.4 | 26.75,89.55 23.7,86.5 23.6,86.5 | v11,90.6 R31.1 11,88.8 11,87.5 11.1,87.4 15.8,87.4 17,86.2 17.4,86.2 | 10.7,67.3 10.6,67.2 10.6,62.3 10.7,62.2 11.8,62.2 C39.2 11.9,62.2 12.3,62.2 12.3,60.5 8.1,56.3 7.3,56.3 6.8,55.8 6.8,54.7 CIN.2 | 10.7,67.3 11.8,67.3 C38.2 | 10.7,67.3 v10.7,69.8 | v29.2,34.5 29.2,35.9 C37.2 | v31.4,35 31.8,35 33,33.8 33,32.5 C35.- 33,32.4 33,31.3 33.7,30.6 40.6,30.6 TPS61028.5 40.7,30.4 41.9,29.2
  Top 0.254: 41.9,29.2 41.9,27.6 C33.2 41.9,27.4 41.9,26.9 44.5,26.9 46.1,25.3 46.1,24.2 R20.1 | IC8.10 34.8,58.7 34.8,57.6 36.4,56 36.4,54.7 CTTC.2 36.4,54.5 C26.2 43.9,50.8 44,50.9 44,52 CC.2 44,52.1 44,55.8 CC1.2 44,56 44,57 44.6,57.6 46.9,57.6 | 38.6,61.7 38.7,61.6 38.7,61.3 38.6,61.2 IC8.16 | 38.5,61.7 IC8.17 | 38.5,61.7 38.6,61.7 | 38.5,61.7 38.5,62.1 38.4,62.2 IC8.18 | v40.2,60.4 40.5,60.4 40.6,60.5 41.9,60.5 RI1.2 42,60.5 45.7,60.5 RI2.2 45.8,60.5 46.9,60.5 47,60.4 47,57.7 46.9,57.6 | v38.6,61.8 38.6,61.7 | v48.1,44.6 49.2,44.6 50.7,46.1 52,46.1 RT2.1 52.1,46.1 53.2,46.1 53.5,46.4 53.5,50.1 52.9,50.7 52.9,52 RTHERMAL.2 52.9,52.2 52.9,53.4 52.85,53.45 | 52.85,53.45 51.6,54.7 49.7,54.7 46.9,57.5 46.9,57.6 | 41.9,29.2 42,29.2 48.3,35.5 TPS61028.8 | USART3/FTDI.1 107.9,96.6 106.4,98.1 103.1,98.1 101.6,96.6 BOOTLOAD.1 101.5,96.5 95.3,90.3 89.8,90.3 88.4,88.9 RESET.P$1 v85,88.9 | C5.2 79.6,76.2 78.1,77.7 78.1,78.7 | 78.1,78.7 78.1,86.4 79.1,86.4 C24.2 79.2,86.4 79.8,86.4 79.8,87.3 80.1,87.6 v80.1,87.8 | v78,78.7 78.1,78.7 | D6.A 37.3,71 39,72.7 39,76.1 R23.1 39,76.2 39,77.4 37.3,79.1 37.3,80 R24.1 37.3,80.1 37.3,81.2 38.6,82.5 40.1,82.5 43.2,85.6 C27_1812.2 | CTTC5.2 CTTC4.2 42.3,94.4 42.2,94.3 42.2,92.3 | 42.2,92.3 42.2,86.6 43.1,85.7 44.4,85.7 C27_1812.2 | C27_1812.2 44.5,85.7 45.9,85.7 50.4,81.2 50.4,80.1 R16.1 50.4,80 50.4,78.9 48.7,77.2 48.7,76.3 R17.1 48.7,76.2 48.7,74.9 48.8,74.8 55.4,74.8 X4.2 54.9,74.7 54.9,67.1 55.7,66.3 55.7,65.6 COUT.2 55.7,65.5 55.7,58.5 55.8,58.4 56.5,58.4 C34.- 56.7,58.4 57.7,58.4 58.3,57.8 58.3,53.7 | v77.9,53.6 78.6,52.9 79.5,52.9 U$1.130
  Top 0.254: v77.9,58.2 78.2,57.9 79.5,57.9 U$1.120 | 83.5,62.3 86.4,62.3 88.4,64.3 88.4,65.2 U$1.94 | 83.5,62.3 83,62.3 81.9,63.4 81.9,65.2 U$1.107 | 83.5,62.3 v83.5,61.7 | R1.1 67.2,52.5 66,52.5 64.3,50.8 C32.2 58.3,50.9 58.3,53.7 | v69.6,53.4 68.7,52.5 67.4,52.5 R1.1 | v53.1,53.7 52.85,53.45 | 58.3,53.7 v56,53.7
  Route2 0.254: v88.9,40.5 88.9,38.5 v90.4,37 | v32,90.2 29.5,90.2 v28.7,89.4 | v29.2,34.5 30.9,34.5 v31.4,35 | v38.6,61.8 38.8,61.8 v40.2,60.4 | TPS61028.10 49.5,39.4 49.5,37 48.3,35.8 48.3,35.6 TPS61028.8 | v80.1,87.8 80.6,88.3 80.6,90.9 80.3,91.2 80.3,94.3 79.3,95.3 77.6,95.3 76.4,96.5 76.2,96.5 ST-LINK1.3 | v78,78.7 75.1,78.7 73.9,77.5 71.2,77.5 C1.2 71,77.5 58.1,77.5 55.4,74.8 X4.2 | v77.9,58.2 78.9,58.2 80.5,59.8 80.5,61.4 81,61.9 83.3,61.9 v83.5,61.7 85.8,61.7 88.6,64.5 92.4,64.5 93.4,63.5 v94.4,63.5 | v56,53.7 v53.1,53.7
  Route3 0.254: v94.4,63.5 93.9,63 93.9,58.4 v94.4,57.9 93.9,58.3 93.9,49 96.05,46.85 | 96.05,46.85 v97.1,45.8 | 96.05,46.85 93.9,44.7 91.4,44.7 88.9,42.2 v88.9,40.5 | SV2.2 158.8,44.4 158.8,36.4 v158,35.6 | v85,88.9 81.2,88.9 v80.1,87.8 | v77.9,58.2 76.9,57.2 76.9,56.1 77.9,55.1 v77.9,53.6 69.8,53.6 v69.6,53.4
  Bottom 0.254: SV1.2 44.5,7.6 44.5,5.1 SV1.1 | 11,91.1 v11,90.6 | v10.7,69.8 10.7,70 | v48.1,44.6 48.3,44.4 48.3,40.7 TPS61028.10
  pour Bottom: 0.6,99.5 13.9,99.5 13.9,91.1 7.2,91.1 7.2,81.2 14.4,81.2 14.4,70 0.6,70
GND2
  Top 0.254: U5.6 149.4,88.5 149.7,88.5 151.9,86.3 151.9,85.6 U5.GND2 | U5.GND1 152.9,98.6 152.9,91.8 149.7,88.6 U5.6 | JP2.5 132.1,87.7 134.1,87.7 135.3,88.9 149.9,88.9 U5.6
LED0  (via drill 0.61)
  Top 0.254: v119.9,19.1 122.4,19.1 D2.C | v109.1,19.1 105.5,22.7 105.2,22.7 U1.30
  Route2 0.254: v109.1,19.1 v119.9,19.1
LED1  (via drill 0.61)
  Top 0.254: v123.5,21.8 D3.C | v107.9,21.8 107.6,21.8 105.5,23.9 105.2,23.9 U1.29
  Route2 0.254: v107.9,21.8 v123.5,21.8
N$1
  Top 0.254: D3.A 127.7,19 127.7,15.5 127.5,15.3 R6.1
N$2
  Top 0.254: D2.A 124,19 124,15.3 R5.1
N$3  (via drill 0.61)
  Top 0.254: v78.1,19.4 80,19.4 R8.2 | v73.7,16.6 73.7,12.9 D4.3
  Route2 0.254: v78.1,19.4 76.5,19.4 v73.7,16.6
N$4  (via drill 0.61)
  Top 0.254: C35.+ 33.1,25.9 41.9,25.9 C33.1 42,25.8 42.9,25.8 45.5,23.2 47,23.2 47.8,24 R20.2 47.9,24.2 52.9,29.2 L4.1 52.4,28.8 48.3,32.9 TPS61028.7 48.3,33.1 52.8,37.6 55.8,37.6 R19.1 | v10.2,35.8 10.2,37.2 C36.1
  Bottom 0.254: v10.2,35.8 16.5,35.8 16.5,37 | 16.5,37 TPS63031.5 | 49.9,37 49.9,34.7 48.3,33.1 TPS61028.7 | 49.9,37 49.9,57 65.1,72.2 JP4.2 | 49.9,37 16.5,37
N$5
  Top 0.254: 147.4,30.2 147.4,28.8 RI3.1 147.5,28.8 149.6,26.7 153.6,26.7 Q1.1 | 147.4,30.2 147.4,32.1 C18.1 | 147.4,30.2 140.2,30.2 139.7,30.7 138.4,30.7 138.1,31 135.7,31 U4.35
N$6
  Top 0.254: 34.8,63.8 IC8.1 | 34.8,63.8 35,64 36.1,64 36.4,63.7 | 36.4,63.7 36.4,63.2 IC8.20 | 36.4,63.7 38,63.7 L3.1 | D6.C 22,70.9 27.6,70.9 34.7,63.8 34.8,63.8
N$7
  Top 0.254: 144,13.1 150.7,13.1 152.8,15.2 RI6.1 | 144,13.1 142.4,13.1 141.6,13.9 141.4,13.9 C23.1 | 144,13.1 144,28.6 142.9,29.7 141.6,29.7 138.6,26.7 134.5,26.7 134.3,26.9 134.3,27.6 135.2,28.5 135.6,28.5 U4.37
N$8
  Top 0.508: JP1.1 17.7,77.4 4.4,77.4 3.7,76.7 J2.2
N$9  (via drill 0.61)
  Top 0.254: C19.1 155.3,34.2 155.3,23.2 153.7,21.6 Q1.2 153.6,21.7 148.3,27 147.4,27 RI3.2 | v139.2,29.7 135.7,29.7 U4.38
  Route2 0.254: v139.2,29.7 145.5,29.7 153.6,21.6 Q1.2
N$10  (via drill 0.61)
  Top 0.254: 15.7,95.3 15.7,88.9 R33.2 | 15.85,95.45 16.9,96.5 CTTC2.1 | 15.85,95.45 15.7,95.3 | CTTC3.1 23.2,96.5 20.5,96.5 19.4,95.4 15.9,95.4 15.85,95.45 | v26.9,87.9 29,87.9 U3.2 | v32.4,95.2 33.9,95.2 L1.1 | 15.7,95.3 5.4,95.3 3.7,97 J1.2
  Route3 0.254: 24.8,87.9 21.6,87.9 12.5,97 J1.2 | 24.8,87.9 v26.9,87.9 | v32.4,95.2 32,95.2 24.8,88 24.8,87.9
N$11
  Top 0.254: C25.1 155.3,8.9 155.3,14.5 154.6,15.2 RI6.2
N$12  (via drill 0.61)
  Top 0.254: 53.9,68.1 53.9,68.9 53.5,69.3 RSNS.1 | 53.9,68.1 53.9,65.6 COUT.1 | 43.55,65.25 46.4,68.1 48.4,68.1 L3.2 48.5,68.1 53.9,68.1 | 43.55,65.25 39,60.7 IC8.15 | v41.4,53.9 42.3,53 42.3,52.1 CC.1 | 43.55,65.25 v47.9,60.9
  Route2 0.254: v41.4,53.9 42.5,55 47.4,55 47.9,55.5 v47.9,60.9
N$13  (via drill 0.61)
  Top 0.254: 142.2,24.5 142.2,21.9 141.9,21.6 RI4.1 | 142.2,24.5 142.2,27 C22.2 | v139.4,26 U4.39 | 142.2,24.5 v140.9,24.5
  Route2 0.254: v140.9,24.5 v139.4,26
N$14  (via drill 0.61)
  Top 0.254: 134.15,28.75 134.5,29.1 136.8,29.1 137,28.9 137,28.2 136.1,27.3 135.7,27.3 U4.40 | 134.15,28.75 133.8,28.4 133.8,26.1 134.5,25.4 136.7,25.4 137.1,25 139.9,25 140.4,25.5 140.4,26.9 142.2,28.7 C22.1 | v143,38.3 143,41.9 RI5.2 | 134.15,28.75 v133.8,29.1
  Route2 0.254: v133.8,29.1 v143,38.3
N$15  (via drill 0.61)
  Top 0.254: v41.2,93.3 33.6,93.3 30.7,90.4 30.7,89.2 U3.14 | C27_1812.1 44.5,89.5 47.7,89.5 50.8,86.4 JP3.1
  Route2 0.254: v41.2,93.3 43.9,93.3 50.8,86.4 JP3.1
N$16  (via drill 0.61)
  Top 0.254: 30.95,91.35 33.6,94 40.4,94 42.5,96.1 CTTC4.1 CTTC5.1 | 30.95,91.35 30.2,90.6 30.2,89.2 U3.15 | v10.1,86.9 9.4,86.2 9.4,85.1 R30.2 | 30.95,91.35 v30.3,92
  Route2 0.254: v10.1,86.9 16,86.9 21.1,92 v30.3,92
N$17  (via drill 0.61)
  Top 0.254: v40.8,56.8 40.8,58.3 38.9,60.2 IC8.14 | RSNS.2 56.4,69.4 56.4,72.2 58.9,74.7 X4.1 59,74.8 65.1,74.8 JP4.1
  Route3 0.254: v40.8,56.8 40.8,57.2 58.3,74.7 58.9,74.7 X4.1
  Bottom 0.254: X4.1 58.9,75.7 50.8,83.8 JP3.2
N$18  (1 unrouted)
N$19
  Top 0.254: U3.10 32,87.4 37,87.4 37.2,87.6 R14.2 37.3,87.6 37.3,83.9 R15.1
N$20  (via drill 0.61)
  Top 0.254: 34.55,84.25 34.7,84.1 34.8,84.1 35.3,83.6 35.3,81.4 31.4,77.5 R3.2 | 34.55,84.25 32,86.8 U3.9 | v38.9,86 38.9,87.6 R14.1 | 34.55,84.25 v36.3,86
  Route2 0.254: v36.3,86 v38.9,86
N$21  (via drill 0.61)
  Top 0.254: v33.8,58.2 33.8,59.2 IC8.9 | v44.1,59 45.6,59 45.7,58.9 RI2.1
  Route2 0.254: v33.8,58.2 36.3,58.2 38.1,60 39.1,60 40.1,59 v44.1,59
N$22  (via drill 0.61)
  Top 0.254: RT1.1 48.3,46.2 50.1,46.2 51.7,47.8 52,47.8 RT2.2 51.7,47.9 51.7,51.6 51.3,52 RTHERMAL.1 51.2,52.1 47.3,56 v46.9,56 | v39.7,57.9 38.2,57.9 37.3,58.8 IC8.12
  Route2 0.254: v39.7,57.9 45,57.9 v46.9,56
N$23  (via drill 0.61)
  Top 0.254: 41.3,55.8 42.3,55.8 CC1.1 | 41.3,55.8 39.6,55.8 36.7,58.7 36.4,58.7 IC8.11 | v45.4,50.7 RT1.2 | v43,54 41.3,55.7 41.3,55.8
  Route2 0.254: v45.4,50.7 45.4,51.6 v43,54
N$24  (via drill 0.61)
  Top 0.254: v17.7,58.4 17.7,61.3 R13.1
  Route2 0.254: v17.7,58.4 14,54.7 LED3.A
N$25
  Top 0.254: R12.1 21.5,61.3 21.5,55.8 20.4,54.7 LED2.A
N$26
  Top 0.254: R11.1 26.7,61.3 26.7,55.9 27.9,54.7 LED1.A
N$27  (via drill 0.61)
  Top 0.254: v32.3,64.3 33.8,62.8 IC8.2
  Bottom 0.254: v32.3,64.3 33.1,63.5 33.1,59 30.5,56.4 30.5,54.7 LED1.K
N$28  (via drill 0.61)
  Top 0.254: v39.2,63.3 38.7,62.8 37.3,62.8 IC8.19
  Route2 0.254: v39.2,63.3 32.1,63.3 23.5,54.7 22.9,54.7 LED2.K
N$29  (via drill 0.61)
  Top 0.254: v32.1,61.2 33.8,61.2 IC8.5
  Bottom 0.254: v32.1,61.2 27.2,56.3 16.6,56.3 16.6,54.7 LED3.K
N$30
  Top 0.254: IC8.7 33.8,60.2 33.3,60.2 32.8,59.7 32.8,56.6 34.7,54.7 CTTC.1
N$31  (via drill 0.61)
  Top 0.254: v38.6,59 37.9,59.7 IC8.13 | v38.6,47.9 36.5,45.8 R10.1
  Route2 0.254: v38.6,47.9 v38.6,59
N$32  (via drill 0.61)
  Top 0.254: v40.3,85.2 39,83.9 R15.2 | v43.4,82.1 46.6,82.1 48.6,80.1 R16.2 | v50.9,77.9 50.4,77.4 50.4,76.2 R17.2
  Route2 0.254: v40.3,85.2 v43.4,82.1 43.5,82.1 47.7,77.9 v50.9,77.9
N$33
  Top 0.254: U3.7 30.7,86.1 30.7,83.7 29.7,82.7 29.7,81.3 R25.2 29.6,81.2 29.6,77.5 R3.1 29.7,77.4 29.7,74.6 35.4,68.9 39.1,68.9 45,74.8 45,80.9 44.8,81.1 43.2,81.1 42.4,80.3 42.4,80.1 R21.2
N$34  (via drill 0.61)
  Top 0.254: v34.3,83.1 31.3,86.1 U3.8 | R22.2 42.4,76.2 v41,77.6 41.5,77.2 44,79.7 44,80 R21.1
  Route2 0.254: v34.3,83.1 35.5,83.1 v41,77.6
N$35
  Top 0.254: 41.35,71.85 44,74.5 44,76.2 R22.1 | 41.35,71.85 38.9,69.4 35.6,69.4 34.6,70.4 34.6,71.5 37.2,74.1 37.2,76.2 R23.2 | R24.2 39,80 39,78.1 41.3,75.8 41.3,71.9 41.35,71.85
N$36
  Top 0.254: C38.1 13.6,67.3 13.6,62.3 C39.1 13.6,62.2 13.6,59.6 17.5,55.7 17.5,48.4 TPS63031.1 16.6,48.3 24.1,48.3 TPS63031.10 24.2,48.2 30.4,42 30.4,20.4 JP5.1
N$37
  Top 0.254: CIN.1 8.4,54.6 8.4,54.4 7.5,53.5 6,53.5 5.8,53.7 5.8,66.4 14.3,74.9 17.7,74.9 JP1.2 17.7,74.8 17.7,63.1 R13.2 17.8,63.1 21.5,63.1 R12.2 21.7,63.1 26.6,63.1 R11.2 26.7,63 27.9,63 | 32.3,59.9 33.1,60.7 33.8,60.7 IC8.6 | 32.3,59.9 32.3,53.2 C26.1 34.7,50.7 34.7,45.8 R10.2 | IC8.4 33.9,61.8 33.9,62.2 IC8.3 33.8,62.2 29.8,62.2 29,63 27.9,63 | 32.3,59.9 29.1,59.9 27.9,61.1 27.9,63
N$38  (via drill 0.61)
  Top 0.254: v56.6,9.6 56.5,9.7 55.4,9.7 U$2.8 | v65.9,9.6 67.1,9.6 67.3,9.4 C31.1
  Route2 0.254: v65.9,9.6 v56.6,9.6
N$39
  Top 0.254: U3.16 29.7,89.2 29.7,91.1 29.3,91.5 29.3,93.6 32.2,96.5 36,96.5 37.2,95.3 L1.2
N$40  (via drill 0.61)
  Top 0.254: v29.7,84.3 30.2,84.8 30.2,86.1 U3.6 | v31.4,82.9 31.4,81.3 R25.1 | v22.1,90.6 22.1,88.9 R26.2
  Route2 0.254: v29.7,84.3 30,84.3 v31.4,82.9
  Bottom 0.254: v22.1,90.6 25.5,87.2 25.5,85.5 26.7,84.3 v29.7,84.3
N$41  (via drill 0.61)
  Top 0.254: 17.8,84 21,84 22,85 R27.2 | 17.8,84 16.6,84 16.4,84.2 16.4,84.3 15.7,85 R28.2 | v20.4,87.6 22.6,87.6 23.7,88.7 R26.1 | 17.8,84 v17.8,83.4
  Route2 0.254: v20.4,87.6 20.2,87.6 19.3,88.5 18.3,88.5 17.8,88 v17.8,83.4
N$42  (via drill 0.61)
  Top 0.254: v28.1,85.9 29,86.8 U3.4 | v24,91 24,92 23.3,92.7 CTTC1.1
  Route2 0.254: v28.1,85.9 28.1,88.2 25.3,91 v24,91
N$43
  Top 0.508: R18.2 36.9,37.7 40.2,37.7 40.6,38.1 TPS61028.2 40.8,38.2 43.5,38.2 49.1,43.8 55,43.8 55.2,43.9 | 55.2,43.9 55.2,44.9 56.3,46 C32.1 56.2,51 54.8,52.4 54.8,53.7 50.1,58.4 C34.+ | 55.2,43.9 57.1,42 JP6.1
N$44
  Top 0.254: R18.1 36.9,35.9 37.8,35.9 40.6,33.1 TPS61028.4
N$45  (via drill 0.61)
  Top 0.254: v53.7,35.9 55.8,35.9 R19.2
  Route2 0.254: v53.7,35.9 48.3,30.5 TPS61028.6
  Route3 0.254: TPS61028.1 40.7,40.6 40.7,39.5 47.2,33 47.2,31.5 48.2,30.5 TPS61028.6
N$46
  Top 0.254: 21.8,77.2 21.8,77.4 22.8,78.4 R29.2 | 21.8,77.2 21.8,75.8 22,75.6 23.7,75.6 24.8,76.7 24.8,80.9 29.7,85.8 29.7,86.1 U3.5 | R30.1 11.1,85 13.9,85 21.7,77.2 21.8,77.2
N$47
  Top 0.254: L4.2 56.3,29.3 56.3,34.9 56.8,35.4 56.8,38.3 56.6,38.5 48.7,38.5 48.3,38.1 TPS61028.9
N$49
  Top 0.254: L7.2 5.1,44.9 15.7,44.9 16.5,45.7 TPS63031.2
N$50  (via drill 0.61)
  Top 0.254: v6.9,41.5 5.1,41.5 L7.1
  Bottom 0.254: v6.9,41.5 16.5,41.5 16.5,40.7 TPS63031.4
N$51
  Top 0.254: TPS63031.8 24.2,43.1 24.2,40.7 TPS63031.7 24.2,40.6 24.2,38.2 TPS63031.6 24.2,38.1 24.6,37.7 29.2,37.7 C37.1
N$52  (via drill 0.61)
  Top 0.254: v9.4,90.6 9.4,88.9 R31.2 | v16.7,91 16.7,92.5 16.9,92.7 R32.1
  Route2 0.254: v9.4,90.6 10.4,91.6 16.1,91.6 v16.7,91
N$53  (via drill 0.61)
  Top 0.254: v26.5,86 27.9,87.4 29,87.4 U3.3 | v18.8,87.5 17.4,88.9 R33.1 17.3,89 18.6,90.3 18.6,92.7 R32.2
  Route2 0.254: v26.5,86 20.3,86 v18.8,87.5
N$57  (via drill 0.61)
  Top 0.254: v68.3,41.4 71.1,41.4 LED7.C | v64.6,41.4 66,41.4 R4.2
  Route2 0.254: v64.6,41.4 v68.3,41.4
NRST  (via drill 0.61)
  Top 0.254: 81.1,87.3 80.9,87.1 80.9,86.4 C24.1 | 81.1,87.3 81.1,89.9 80.9,90.1 R9.1 80.9,90.2 80.9,96.2 81.2,96.5 ST-LINK1.5 | v93.4,45.7 93.4,44.1 U$1.25 | v95,69.1 95,69.3 93.4,70.9 93.4,87.3 | 93.4,87.3 93.4,88.9 RESET.P$2 | 93.4,87.3 81.1,87.3
  Bottom 0.254: v93.4,45.7 93.4,67.5 v95,69.1
PA0  (via drill 0.61)
  Top 0.254: v123.6,42.9 98.1,42.9 97.9,43.1 97.9,44 U$1.34
  Route2 0.254: v123.6,42.9 128.9,48.2 157.4,48.2 SV2.3
PA1  (via drill 0.61)
  Top 0.254: v105.8,45.4 98.9,45.4 98.4,44.9 98.4,44.1 U$1.35
  Bottom 0.254: v105.8,45.4 126.1,45.4 131.5,50.8 SV2.4
PA2  (via drill 0.61)
  Top 0.254: v100,44 99,44 U$1.36
  Bottom 0.254: v100,44 95.9,39.9 95.9,7 MICROPHONE.3
PA4  (via drill 0.61)
  Top 0.254: v99.1,47.4 100.7,47.4 U$1.40
  Bottom 0.254: v99.1,47.4 104.4,52.7 104.4,64.4 112.6,72.6 157.4,72.6 157.4,73.6 SV3.14
PA5  (via drill 0.61)
  Top 0.254: v56.5,7.2 55.8,6.5 53.3,6.5 52,7.8 52,10.7 52.5,11.2 52.9,11.2 U$2.3 | v103.7,47.6 102,47.6 101.7,47.9 100.8,47.9 U$1.41
  Route3 0.254: v56.5,7.2 68.2,7.2 85.5,24.5 85.5,27.5 103.7,45.7 v103.7,47.6
PA6  (via drill 0.61)
  Top 0.254: v104.9,48.6 103.2,48.6 103,48.4 100.8,48.4 U$1.42
  Bottom 0.254: v104.9,48.6 104.9,64.2 111.8,71.1 154.9,71.1 SV3.11
PA7  (via drill 0.61)
  Top 0.254: v54.7,7.5 53,7.5 52.5,8 52.5,9 53.2,9.7 53.8,9.7 U$2.5 | v95.7,50.1 98.6,50.1 99.8,48.9 100.7,48.9 U$1.43
  Bottom 0.254: v54.7,7.5 55.6,8.4 55.6,10.1 58.7,13.2 95.4,13.2 95.4,40.6 94.9,41.1 94.9,49.3 v95.7,50.1
PA8  (via drill 0.61)
  Top 0.254: v85.4,63.5 85.4,65.2 U$1.100
  Route3 0.254: v106.8,70.1 156.4,70.1 157.4,71.1 SV3.12
  Bottom 0.254: v85.4,63.5 92,70.1 v106.8,70.1
PA9  (via drill 0.61)
  Top 0.254: v85.3,74.2 84.9,73.8 84.9,65.3 U$1.101
  Route2 0.254: v85.3,74.2 85.3,87.7 91.4,93.8 91.4,96.5 BOOTLOAD.5
PA10  (via drill 0.61)
  Top 0.254: v83.9,66.9 84.4,66.4 84.4,65.3 U$1.102
  Route2 0.254: SV3.3 154.9,61 149.1,61 114.1,96 114.1,96.9 113.4,97.6 95,97.6 94,96.6 BOOTLOAD.4
  Route3 0.254: v83.9,66.9 83.9,71.3 97.6,85 97.6,96.9 96.9,97.6 95,97.6 94,96.6 BOOTLOAD.4
PA13  (via drill 0.61)
  Top 0.254: v83.4,74.4 82.9,73.9 82.9,65.3 U$1.105
  Route2 0.254: v83.4,74.4 83.4,91.9 78.8,96.5 ST-LINK1.4
PA14
  Top 0.254: U$1.109 79.5,63.4 79.5,63.7 70,73.2 70,97.5 70.7,98.2 72,98.2 73.6,96.6 ST-LINK1.2
PA15  (via drill 0.61)
  Top 0.254: v50.5,11.7 52.9,11.7 U$2.2 | v80.3,64.4 80.3,64.1 80.7,63.7 80.7,63.1 80.5,62.9 79.6,62.9 U$1.110
  Route2 0.254: v50.5,11.7 50.5,30.2 76.9,56.6 76.9,61 v80.3,64.4
PB2
  Top 0.254: R7.2 102.3,50.8 101.7,51.4 100.8,51.4 U$1.48
PB4  (via drill 0.61)
  Top 0.254: v53.5,8.5 54.3,8.5 54.4,8.6 54.4,9.7 U$2.6 | v77.9,50.6 78.2,50.9 79.5,50.9 U$1.134
  Route2 0.254: v53.5,8.5 53.5,11.1 53.4,11.2 53.4,16.6 64,27.2 64.8,27.2 67.6,30 67.6,30.8 68.1,31.3 69,31.3 71.5,33.8 71.5,44.2 v77.9,50.6
PB8  (via drill 0.61)
  Top 0.254: v84.5,49.9 83.9,49.9 82.4,48.4 79.6,48.4 U$1.139
  Route3 0.254: v84.5,49.9 84.5,52.6 93.4,61.5 93.4,64.9 100.7,72.2 150.9,72.2 154.9,76.2 SV3.15
PB9  (via drill 0.61)
  Top 0.254: v77.9,47.9 79.5,47.9 U$1.140
  Route2 0.254: v77.9,47.9 77.9,49 91.4,62.5 106.3,62.5 v121.1,77.3
  Bottom 0.254: v121.1,77.3 157.4,77.3 157.4,76.2 SV3.16
PB10  (via drill 0.61)
  Top 0.254: v102.5,61.2 101.8,61.9 100.8,61.9 U$1.69 | v125.9,37.8 126.2,37.8 127.8,36.2 128.3,36.2 U4.43
  Route3 0.254: v125.9,37.8 v102.5,61.2
PB11  (via drill 0.61)
  Top 0.254: v126.9,44.7 127,44.8 127,51.5 116.1,62.4 100.8,62.4 U$1.70 | v130.3,37.6 128.5,37.6 128.4,37.5 U4.44
  Route2 0.254: v126.9,44.7 126.9,41 v130.3,37.6
PB12  (via drill 0.61)
  Top 0.254: v101.9,65.2 99,65.2 U$1.73 | v128.9,46.6 135.5,40 U4.28
  Route3 0.254: v101.9,65.2 110.3,65.2 v128.9,46.6
PB13  (via drill 0.61)
  Top 0.254: v99.2,66.9 98.4,66.1 98.4,65.3 U$1.74 | v123.9,36.5 126.7,33.7 128.3,33.7 U4.45
  Route3 0.254: v99.2,66.9 99.2,61.2 v123.9,36.5
PB14  (via drill 0.61)
  Top 0.254: v100.8,66.8 99.7,67.9 98.7,67.9 97.9,67.1 97.9,65.3 U$1.75 | v121.2,44.4 125.7,44.4 132.6,37.5 135.5,37.5 U4.30
  Route3 0.254: v100.8,66.8 100.8,64.8 v121.2,44.4
PC1  (via drill 0.61)
  Top 0.254: v95.9,41.6 94.4,43.1 94.4,44 U$1.27 | v126.5,35.4 127.8,35.4 128.3,34.9 U4.46
  Route2 0.254: v95.9,41.6 120.3,41.6 v126.5,35.4
PC4  (via drill 0.61)
  Top 0.254: v51.7,12.7 52.2,12.2 52.9,12.2 U$2.1 | v106.8,46.6 106.8,48.2 105.4,49.6 101.9,49.6 101.7,49.4 100.8,49.4 U$1.44
  Route3 0.254: v51.7,12.7 51.7,8.8 54.3,6.2 70,6.2 106.8,43 v106.8,46.6
PC5  (via drill 0.61)
  Top 0.254: v54.6,11.1 54.9,10.8 54.9,9.8 U$2.7 | v92.3,48.2 95.2,51.1 98.6,51.1 99.8,49.9 100.7,49.9 U$1.45
  Route2 0.254: v54.6,11.1 54.6,12.8 88.3,46.5 88.3,46.9 89.6,48.2 v92.3,48.2
PC6  (via drill 0.61)
  Top 0.254: v92.4,66.9 92.2,66.7 88,66.7 87.4,66.1 87.4,65.3 U$1.96
  Route2 0.254: v92.4,66.9 96.1,66.9 99.3,63.7 v105.9,63.7
  Bottom 0.254: v105.9,63.7 108.4,61.2 153.9,61.2 153.9,61.4 154.5,62 157.4,62 157.4,61 SV3.4
PC8  (via drill 0.61)
  Top 0.254: U5.7 149.1,87.5 140.6,87.5 139.7,88.4 135.5,88.4 132.1,85 JP2.6 | v86.4,66.9 86.4,65.3 U$1.98
  Route3 0.254: v104.5,85 v86.4,66.9
  Bottom 0.254: v104.5,85 132,85 JP2.6
PC12  (via drill 0.61)
  Top 0.254: U5.4 149.3,90.8 134,90.8 132.1,92.7 JP2.3 | v77.7,63.3 77.7,62.3 78.6,61.4 79.5,61.4 U$1.113
  Bottom 0.254: v77.7,63.3 78.8,64.4 78.8,71.3 100.2,92.7 132,92.7 JP2.3
PC13  (via drill 0.61)
  Top 0.254: v77.2,39.9 71.2,39.9 LED7.A | v84.8,45.7 84.8,45.3 84.4,44.9 84.4,44.1 U$1.7
  Route2 0.254: v77.2,39.9 79,39.9 v84.8,45.7 85,45.7 88.5,49.2 92.8,49.2 92.9,49.1 95.3,49.1 98.8,45.6 103.4,45.6 107.5,49.7 v112.5,49.7
  Bottom 0.254: v112.5,49.7 112.5,51.8 148.3,51.8 154.9,58.4 SV3.1
PC14  (via drill 0.61)
  Top 0.254: 71.9,30.6 71.9,22.9 C3.1 | 71.9,30.6 67,35.5 XTAL3.1 | v84.9,41.4 84.9,44 U$1.8 | 71.9,30.6 v74.1,30.6
  Route2 0.254: v74.1,30.6 v84.9,41.4
PC15  (via drill 0.61)
  Top 0.254: v64,25.7 64,22.9 C2.1 | v68.6,30.3 68.6,31.9 65.2,35.3 65.2,35.5 XTAL3.2 | v86.2,42.3 85.4,43.1 85.4,44 U$1.9
  Route2 0.254: v68.6,30.3 v64,25.7
  Bottom 0.254: v86.2,42.3 86,42.1 86,39.3 78.3,31.6 68.6,31.6 v68.6,30.3
PCM_CLK  (via drill 0.61)
  Top 0.254: v107.6,32 107.6,30.6 U1.24 | v126.5,29.7 126.8,29.7 127.9,28.6 128.4,28.6 U4.49
  Route2 0.254: v107.6,32 110.6,32 112.9,29.7 v126.5,29.7
PCM_IN  (via drill 0.61)
  Top 0.254: v112.1,32 111.2,31.1 111.2,30.6 U1.21 | v125.7,32 127.9,29.8 U4.50
  Route2 0.254: v125.7,32 v112.1,32
PCM_SYNC  (via drill 0.61)
  Top 0.254: v111.5,33.5 108.8,30.8 108.8,30.6 U1.23 | v121.2,33.5 127.4,27.3 128.4,27.3 U4.52
  Route2 0.254: v121.2,33.5 v111.5,33.5
PD1
  Top 0.254: FET1.1 65,59.4 77.7,59.4 78.7,60.4 79.5,60.4 U$1.115
PD2  (via drill 0.61)
  Top 0.254: U5.3 149.1,91.8 139.9,91.8 139.7,91.6 135.7,91.6 132.1,95.2 JP2.2 | v87,60.4 86.5,59.9 79.6,59.9 U$1.116
  Route3 0.254: v87,60.4 87,64.1 102.8,79.9 116.7,79.9 132,95.2 JP2.2
PD3  (via drill 0.61)
  Top 0.254: v94.9,61.5 92.8,59.4 79.6,59.4 U$1.117
  Route3 0.254: v94.9,61.5 94.9,62.5 98.2,65.8 98.2,67.4 98.7,67.9 153.1,67.9 154.9,66.1 SV3.7
PD6  (via drill 0.61)
  Top 0.254: S2.2 7.7,21 10.5,23.8 10.5,24.1 R35.1 10.7,24.1 v12.1,25.5 | v83.5,56.9 79.6,56.9 U$1.122
  Route2 0.254: v55,49.7 48.3,49.7 24.1,25.5 v12.1,25.5
  Bottom 0.254: v83.5,56.9 78.9,56.9 78.9,56.1 72.5,49.7 v55,49.7
PD7  (via drill 0.61)
  Top 0.254: v9.2,19.4 10.1,20.3 10.5,20.3 R36.1 | v8.6,15.9 8.6,15.6 7.7,14.7 S3.2 | v81.3,55.9 80.8,56.4 79.6,56.4 U$1.123
  Route2 0.254: v9.2,19.4 9.2,18.9 8.6,18.3 v8.6,15.9
  Bottom 0.254: v81.3,55.9 78.9,53.5 78.9,53.1 69.3,43.5 69.3,40.9 56.2,27.8 9.2,27.8 v9.2,19.4
PD8  (via drill 0.61)
  Top 0.254: v108.1,80.9 108.1,69.9 102.3,64.1 97.1,64.1 96.9,64.3 96.9,65.2 U$1.77
  Route3 0.254: v108.1,80.9 108.1,86.5 118.1,96.5 USART3/FTDI.5
PD9
  Top 0.254: U$1.78 96.4,65.3 96.4,70.5 107.1,81.2 107.1,89.9 112,94.8 113.8,94.8 115.5,96.5 USART3/FTDI.4
PD11  (via drill 0.61)
  Top 0.254: R39.2 12.3,8.9 17.3,13.9 17.4,13.9 19.6,16.1 19.6,19 21.5,20.9 S6.2 21.7,21 22,21.3 v22,22.2 | v89.5,73.1 95.4,67.2 95.4,65.3 U$1.80
  Route2 0.254: v89.5,73.1 83,73.1 51.6,41.7 45.7,41.7 40.6,36.6 36.4,36.6 v22,22.2
PD12  (via drill 0.61)
  Top 0.254: 20.65,13.75 21.5,14.6 S7.2 | 20.65,13.75 20.5,13.6 20.5,10.6 15,5.1 12.3,5.1 R40.2 | v80.4,77.2 83.9,77.2 94.9,66.2 94.9,65.3 U$1.81 | v20.6,15.9 20.6,13.8 20.65,13.75
  Route3 0.254: v80.4,77.2 80.4,76.6 49.4,45.6 43.9,45.6 20.6,22.3 v20.6,15.9
PE3  (via drill 0.61)
  Top 0.254: v89.3,46.4 86.8,48.9 83.6,48.9 81.9,47.2 81.9,44.1 U$1.2 | v130,50.8 149.8,50.8 157.4,58.4 SV3.2
  Route2 0.254: v89.3,46.4 89.6,46.4 93,43 122.2,43 v130,50.8
PE4  (via drill 0.61)
  Top 0.254: v80.4,43.6 81.1,42.9 82.2,42.9 82.4,43.1 82.4,44 U$1.3
  Route2 0.254: v80.4,43.6 80.4,47.3 87.5,54.4 123.4,54.4 v134,65
  Bottom 0.254: v134,65 157.4,65 157.4,66 SV3.8
PE5  (via drill 0.61)
  Top 0.254: v85,39.8 82.9,41.9 82.9,44 U$1.4
  Route3 0.254: v85,39.8 88.1,39.8 88.4,39.5 90.2,39.5 95.5,44.8 99.2,44.8 104,49.6 109.3,49.6 123.4,35.5 125.1,35.5 154.6,65 155.4,65 156.4,66 156.4,67.5 SV3.10
PE6  (via drill 0.61)
  Top 0.254: v85.7,47.9 83.3,47.9 82.4,47 82.4,46 83.4,45 83.4,44.1 U$1.5 | v140.3,53.9 154.9,68.5 SV3.9
  Route2 0.254: v85.7,47.9 86.5,47.9 92.5,53.9 v140.3,53.9
PF6  (via drill 0.61)
  Top 0.254: v79,38.7 88.6,38.7 89.9,40 89.9,44 U$1.18
  Route3 0.254: v79,38.7 73,38.7 44.5,10.2 SV1.3
PF7  (via drill 0.61)
  Top 0.254: v86.6,36 90.4,39.8 90.4,44 U$1.19
  Bottom 0.254: v86.6,36 64.3,13.7 44.5,13.7 44.5,12.7 SV1.4
PF10  (via drill 0.61)
  Top 0.254: S8.2 21.5,8.2 20.5,7.2 20.5,3.9 20.7,3.7 26.2,3.7 27.3,2.6 27.5,2.6 R41.2 27,3 v29,3 | v92.4,38 91.9,38.5 91.9,44 U$1.22
  Route2 0.254: v92.4,38 92.4,37.4 66.9,11.9 66.9,9.1 60.8,3 v29,3
PG2  (via drill 0.61)
  Top 0.254: S4.2 7.7,8.3 8.7,9.3 8.7,12.5 10.5,14.3 10.5,16.5 R37.1 10.6,16.6 12.5,18.5 v12.5,18.8 | v91.9,61.5 91.9,65.2 U$1.87
  Bottom 0.254: v91.9,61.5 88.5,58.1 88.5,52.4 83.6,47.5 81.3,47.5 52.6,18.8 v12.5,18.8
PG3  (via drill 0.61)
  Top 0.254: 21.05,26.85 21.5,27.3 S5.2 | 21.05,26.85 20.5,26.3 20.5,22.9 12.3,14.7 12.3,12.7 R38.2 | v90.9,63.5 91.4,64 91.4,65.2 U$1.88 | v29.4,26.8 21.1,26.8 21.05,26.85
  Bottom 0.254: v90.9,63.5 88,60.6 88,54.9 59.9,26.8 v29.4,26.8
PG7  (via drill 0.61)
  Top 0.254: S1.2 7.7,27.4 8.2,27.9 10.5,27.9 R34.1 10.7,27.9 v10.7,29.4 | v81.5,60.9 81.7,60.7 85.8,60.7 89.4,64.3 89.4,65.2 U$1.92
  Route2 0.254: v67.5,60.9 58.8,60.9 27.3,29.4 v10.7,29.4
  Route3 0.254: v67.5,60.9 v81.5,60.9
PG9  (via drill 0.61)
  Top 0.254: v77.9,56.6 78.6,55.9 79.5,55.9 U$1.124
  Bottom 0.254: v77.9,56.6 79.3,58 79.3,66.3 88.1,75.1 154.9,75.1 154.9,73.7 SV3.13
PG10  (via drill 0.61)
  Top 0.254: v75.9,57.1 77.6,55.4 79.5,55.4 U$1.125
  Route2 0.254: v137.5,74.1 137.5,73.3 146,64.8 156.1,64.8 157.4,63.5 SV3.6 | v96.6,72.2 96.1,71.7 91.8,71.7 90.3,70.2 86.8,70.2 86.3,69.7 83.5,69.7 83.3,69.5 80.8,69.5 80.3,69 80.3,66.6 78,64.3 77.2,64.3 76.4,63.5 76.4,57.6 v75.9,57.1
  Route3 0.254: v137.5,74.1 102.1,74.1 100.7,72.7 97.1,72.7 v96.6,72.2
PG11  (via drill 0.61)
  Top 0.254: v85.3,54.9 79.6,54.9 U$1.126
  Route2 0.254: v85.3,54.9 121.2,54.9 v129.1,62.8
  Bottom 0.254: v129.1,62.8 154.9,62.8 154.9,63.5 SV3.5
PH0  (via drill 0.61)
  Top 0.254: C21.1 84.3,15.3 84.3,22 86.4,24.1 XTAL1.2 | v91.8,45.7 92.4,45.1 92.4,44.1 U$1.23
  Bottom 0.254: v91.8,45.7 87.6,41.5 87.6,25.3 86.5,24.2 XTAL1.2
PH1  (via drill 0.61)
  Top 0.254: C20.1 93.5,15.3 93.5,22 91.4,24.1 XTAL1.1 | v92.9,40.7 92.9,44 U$1.24
  Bottom 0.254: v92.9,40.7 93.4,40.2 93.4,33 91.9,31.5 91.9,24.7 91.4,24.2 XTAL1.1
SCK1
  Top 0.254: U5.5 149.1,89.7 132.5,89.7 132.1,90.1 JP2.4
VBAT  (via drill 0.61)
  Top 0.254: v81.4,21.9 80.7,21.2 80.1,21.2 R8.1 | v83.4,46.5 83.4,45.7 83.9,45.2 83.9,44.1 U$1.6
  Route3 0.254: v81.4,21.9 81.4,41.9 83.4,43.9 v83.4,46.5 83.4,46.6 82.5,47.5 82.5,63.7 v77.3,68.9
  Bottom 0.254: C1.1 76.2,70 v77.3,68.9
VCAP_1
  Top 0.254: C4.1 126.1,68.5 107.4,68.5 101.8,62.9 100.8,62.9 U$1.71
VCAP_2
  Top 0.254: C5.1 83.4,75.9 82.4,74.9 82.4,65.3 U$1.106
VDDA
  Top 0.254: L2.2 C13.1 C14.1 87.7,32.7 88,33 88,35.5 R2.2 88.1,35.6 88.1,36.2 89.9,38 90.9,38 91.9,37 94.9,37 97.4,39.5 97.4,44 U$1.33
VREF  (via drill 0.61)
  Top 0.254: C16.1 92.9,30.9 | 92.9,30.9 C15.1 | v89.8,33.3 89.8,35.5 R2.1 | v92.9,31 92.9,30.9 | v94.4,38 96.9,40.5 96.9,44 U$1.32
  Route2 0.254: v92.9,31 90.6,33.3 v89.8,33.3 89.8,33.4 v94.4,38
(copper drawn outside any net)
  shapes: Top area x2